# EAGLE design 612_jetracer_328_210 (EAGLE 9.6.2)
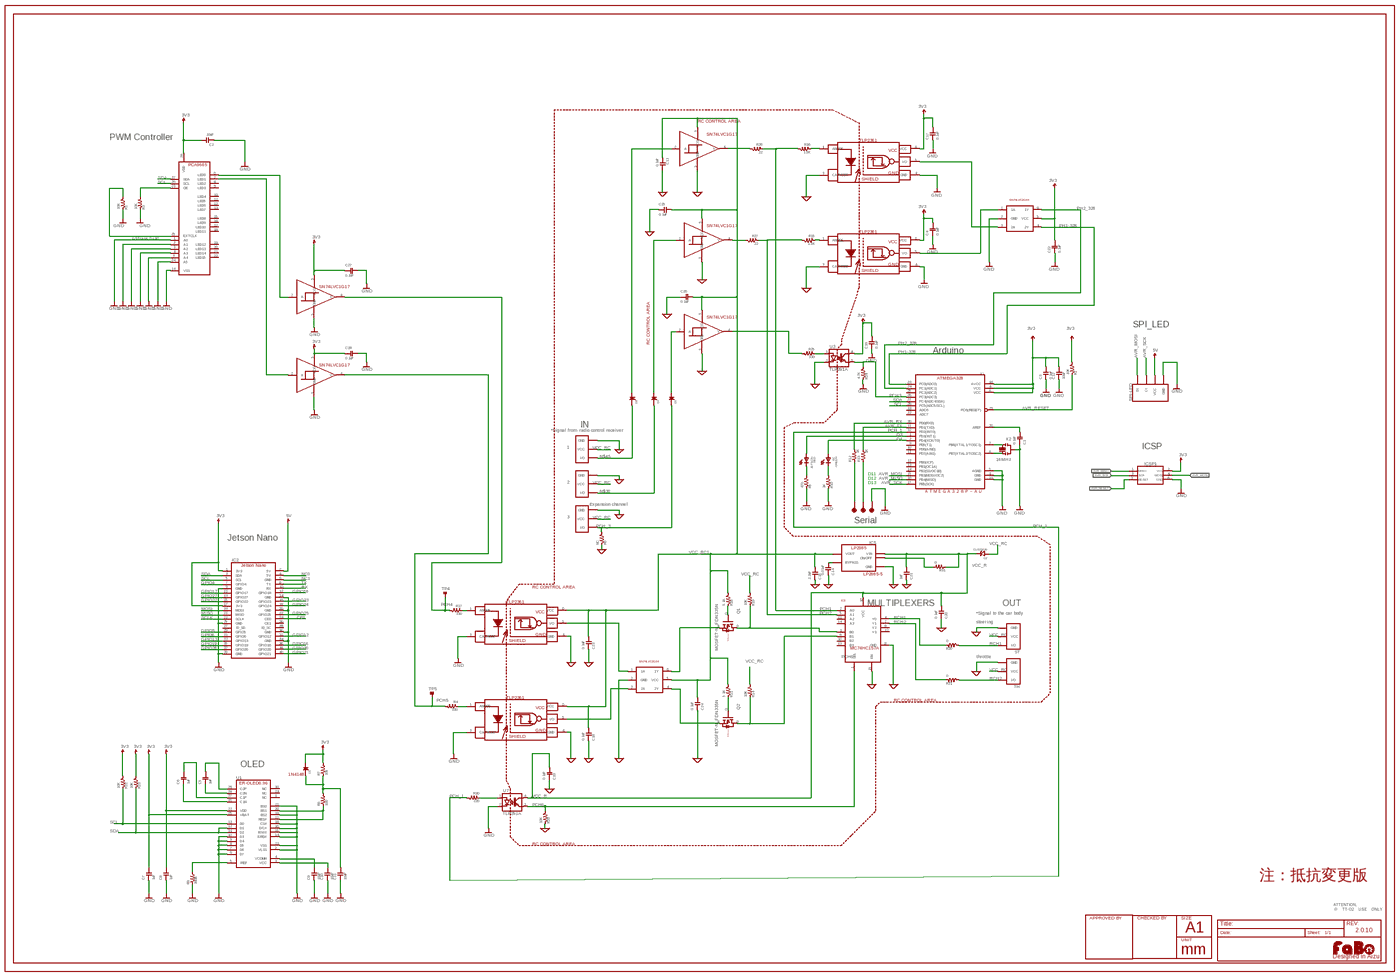
[diagram p0: schematic, sheet 1, overview]
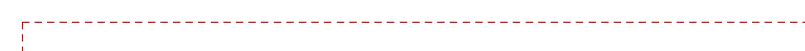
[diagram p1: schematic, sheet 1, part 1 of 4]
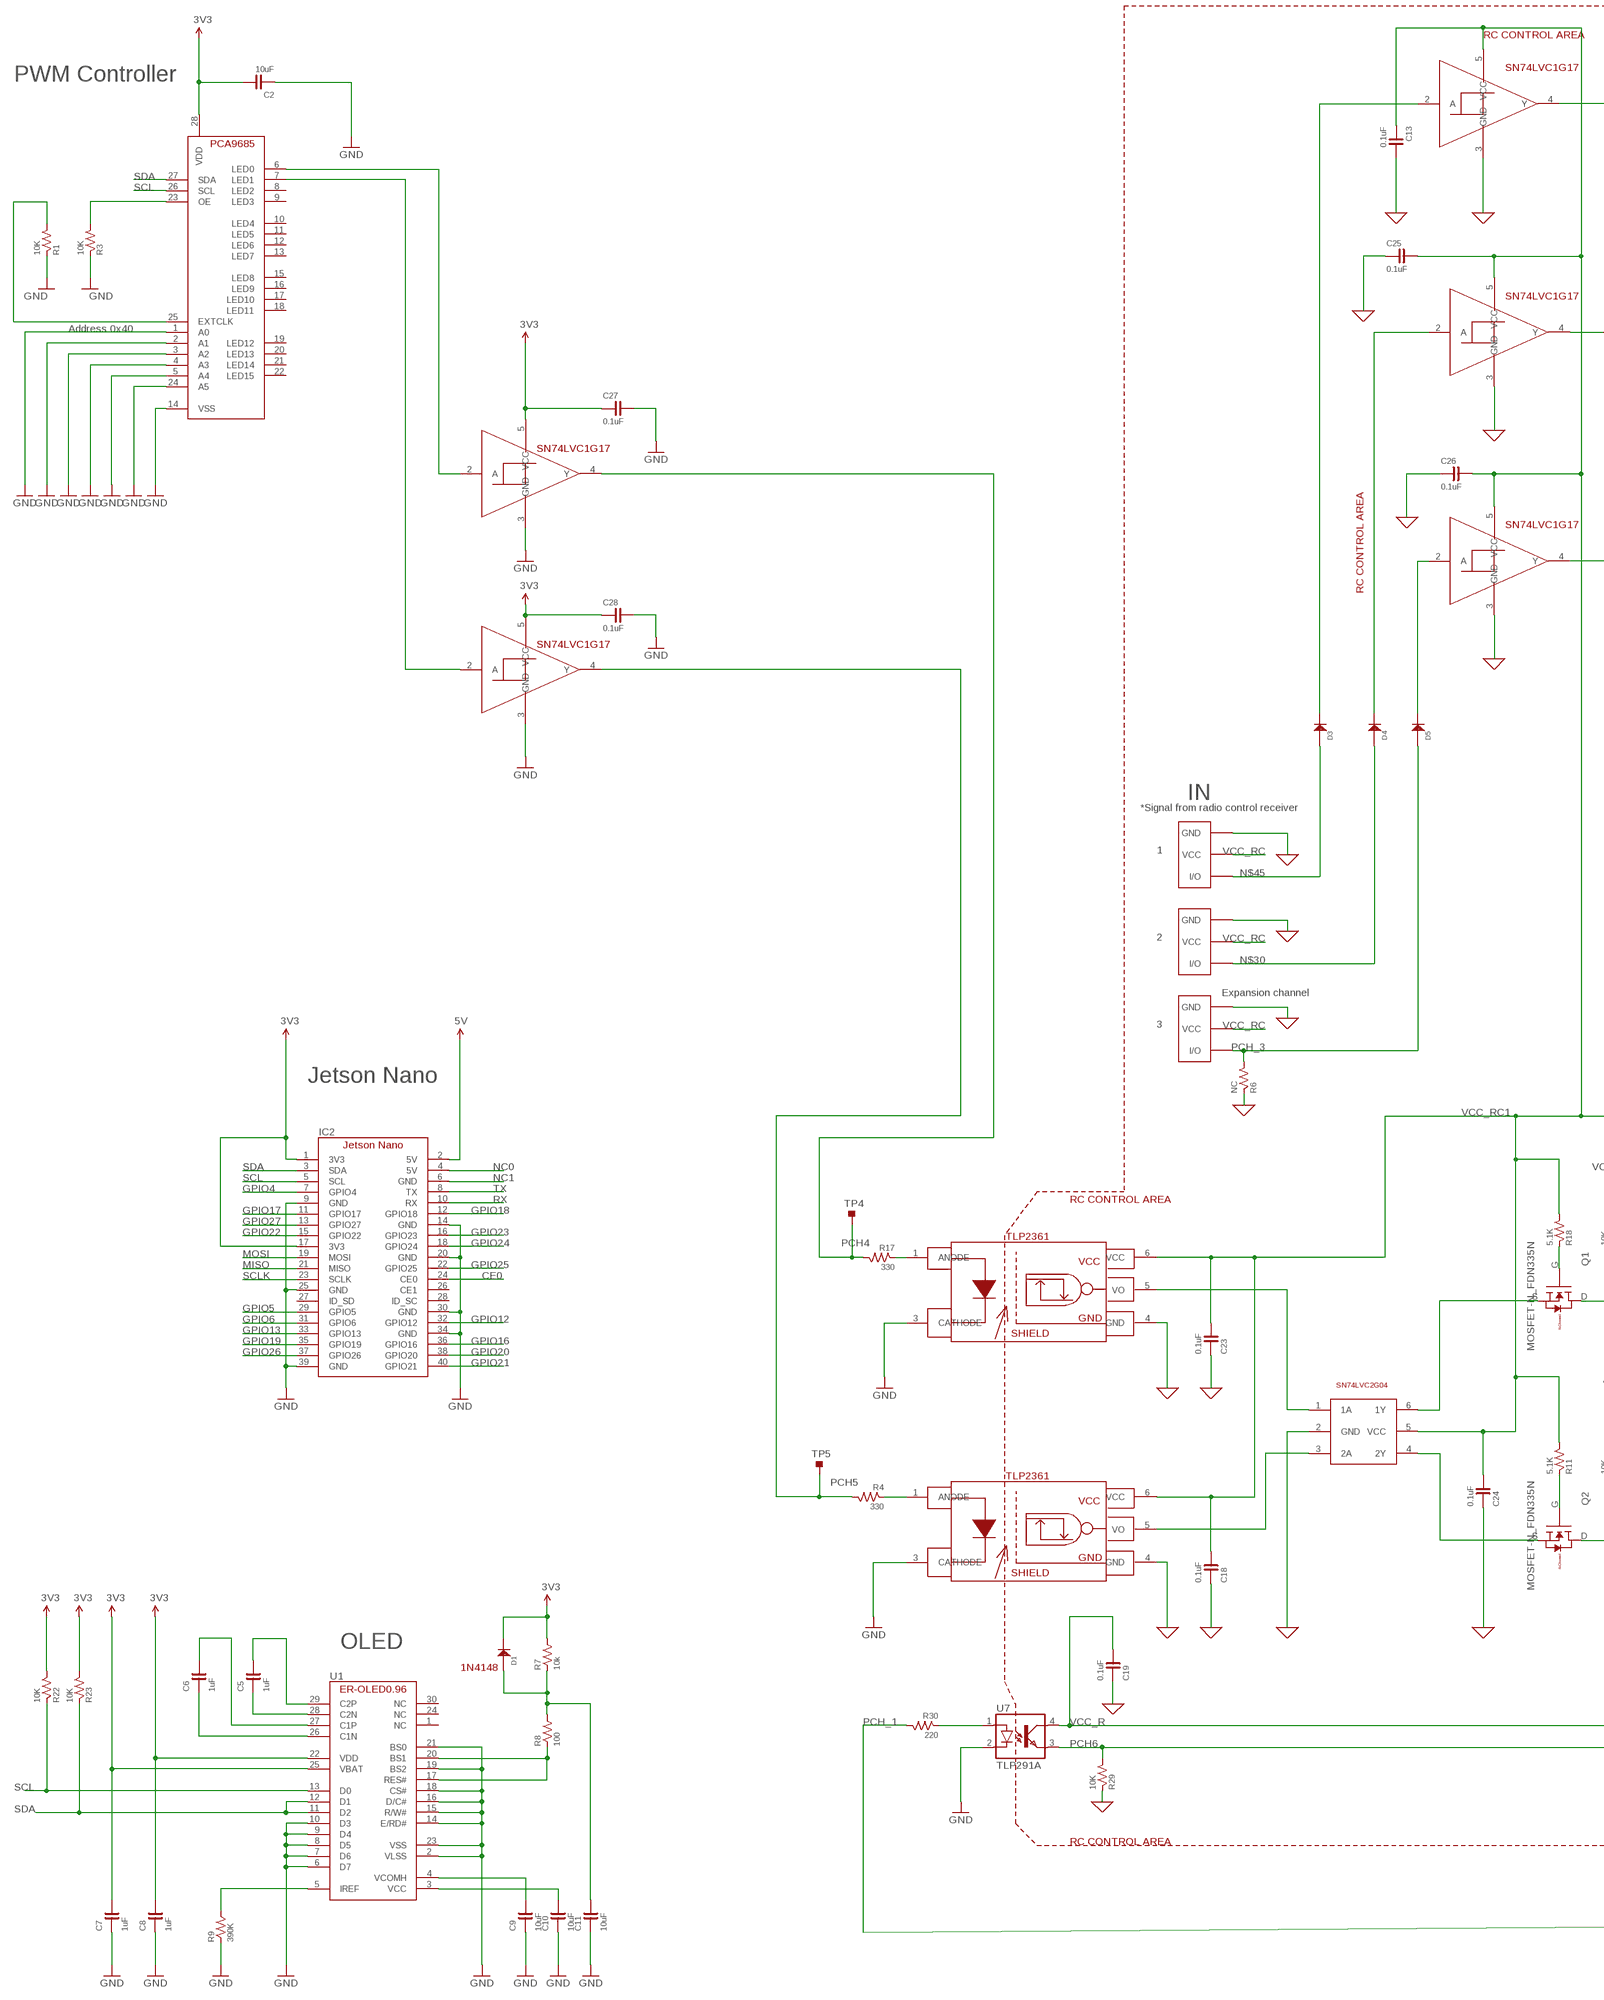
[diagram p2: schematic, sheet 1, part 2 of 4]
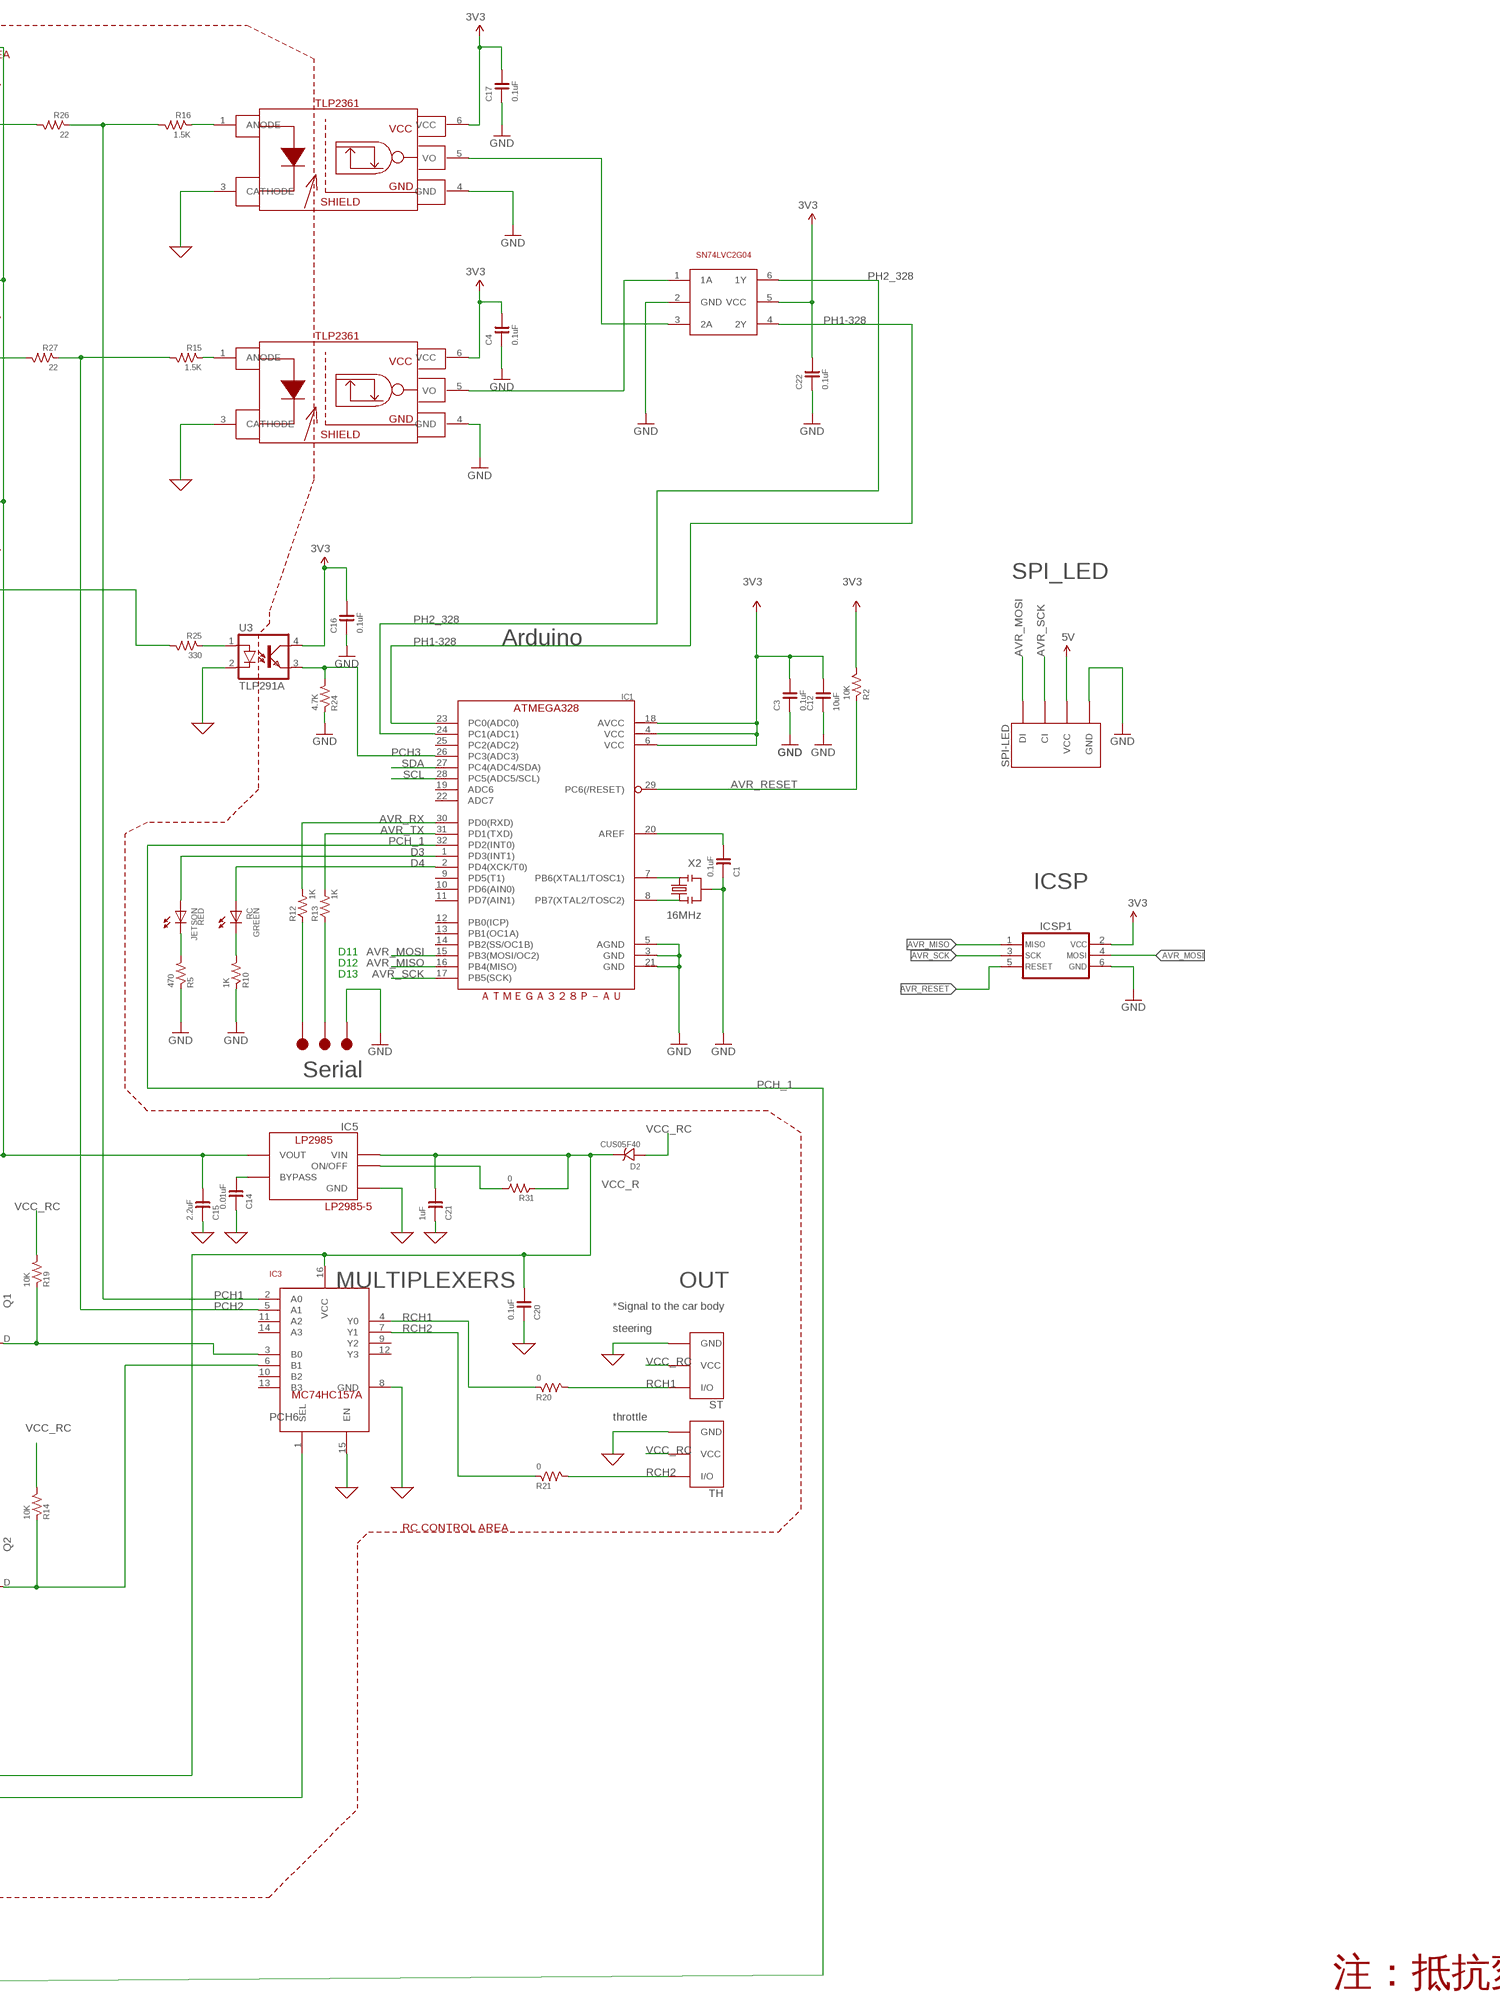
[diagram p3: schematic, sheet 1, part 3 of 4]
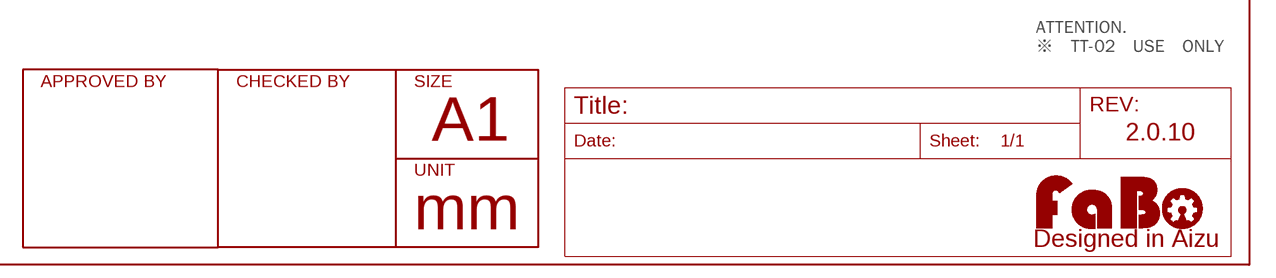
[diagram p4: schematic, sheet 1, part 4 of 4]

## Parts
1  FABO_BRICK_3PIN-HEADER  [FABO_BRICK_3PIN_HEADER]
2  FABO_BRICK_3PIN-HEADER  [FABO_BRICK_3PIN_HEADER]
3  FABO_BRICK_3PIN-HEADER  [FABO_BRICK_3PIN_HEADER]
C1  0.1uF  CAPACITOR-0603  [0603]
C2  10uF  CAPACITOR-0603  [0603]
C3  0.1uF  CAPACITOR-0603-BOTTOM  [0603-BOTTOM]
C4  0.1uF  CAPACITOR-0603-BOTTOM  [0603-BOTTOM]
C5  1uF  CAPACITOR-0603-BOTTOM  [0603-BOTTOM]
C6  1uF  CAPACITOR-0603-BOTTOM  [0603-BOTTOM]
C7  1uF  CAPACITOR-0603-BOTTOM  [0603-BOTTOM]
C8  1uF  CAPACITOR-0603-BOTTOM  [0603-BOTTOM]
C9  10uF  CAPACITOR-0603-BOTTOM  [0603-BOTTOM]
C10  10uF  CAPACITOR-0603-BOTTOM  [0603-BOTTOM]
C11  10uF  CAPACITOR-0603-BOTTOM  [0603-BOTTOM]
C12  10uF  CAPACITOR-0603-BOTTOM  [0603-BOTTOM]
C13  0.1uF  CAPACITOR-0603  [0603]
C14  0.01uF  CAPACITOR-0603  [0603]
C15  2.2uF  CAPACITOR-0603  [0603]
C16  0.1uF  CAPACITOR-0603-BOTTOM  [0603-BOTTOM]
C17  0.1uF  CAPACITOR-0603_NARROW  [0603-NARROW]
C18  0.1uF  CAPACITOR-0603  [0603]
C19  0.1uF  CAPACITOR-0603  [0603]
C20  0.1uF  CAPACITOR-0603  [0603]
C21  1uF  CAPACITOR-0603  [0603]
C22  0.1uF  CAPACITOR-0603-BOTTOM  [0603-BOTTOM]
C23  0.1uF  CAPACITOR-0603  [0603]
C24  0.1uF  CAPACITOR-0603  [0603]
C25  0.1uF  CAPACITOR-0603  [0603]
C26  0.1uF  CAPACITOR-0603  [0603]
C27  0.1uF  CAPACITOR-0603  [0603]
C28  0.1uF  CAPACITOR-0603  [0603]
D1  1N4148  [1N4148W]
D2  CUS05F40  [CUS05F40]
D3  1N4148  [1N4148W]
D4  1N4148  [1N4148W]
D5  1N4148  [1N4148W]
IC1  ATMEGA328P-AU  [TQFP-32]
IC2  JETSON_NANO_NOBORDER  [JETSON_NANO_NOBOARDER]
IC3  MULTIPLEXERSMC74HC157A  [TSSOP-16]
IC4  PCA9685_BOTTOM  [PCA9685_BOTTOM]
IC5  LP2985-33DBV  [SOT-23-5]
ICSP1  ICSP_AVR-TC_NOHOLE  [TC2030]
JETSON  GREEN  LED-0603  [0603]
Q1  MOSFET-N_FDN335N  [SUPERSOT-3]
Q2  MOSFET-N_FDN335N  [SUPERSOT-3]
R1  10K  RESISTOR-0603  [0603]
R2  10K  RESISTOR-0603  [0603]
R3  10K  RESISTOR-0603  [0603]
R4  330  RESISTOR-0603  [0603]
R5  470  RESISTOR-0603  [0603]
R6  NC  RESISTOR-0603  [0603]
R7  10k  RESISTOR-0603-BOTTOM  [0603-BOTTOM]
R8  100  RESISTOR-0603-BOTTOM  [0603-BOTTOM]
R9  390K  RESISTOR-0603-BOTTOM  [0603-BOTTOM]
R10  1K  RESISTOR-0603  [0603]
R11  5.1K  RESISTOR-0603  [0603]
R12  1K  RESISTOR-0603  [0603]
R13  1K  RESISTOR-0603  [0603]
R14  10K  RESISTOR-0603  [0603]
R15  1.5K  RESISTOR-0603  [0603]
R16  1.5K  RESISTOR-0603  [0603]
R17  330  RESISTOR-0603  [0603]
R18  5.1K  RESISTOR-0603  [0603]
R19  10K  RESISTOR-0603  [0603]
R20  0  RESISTOR-0603  [0603]
R21  0  RESISTOR-0603  [0603]
R22  10K  RESISTOR-0603  [0603]
R23  10K  RESISTOR-0603  [0603]
R24  4.7K  RESISTOR-0603  [0603]
R25  330  RESISTOR-0603  [0603]
R26  22  RESISTOR-0603  [0603]
R27  22  RESISTOR-0603  [0603]
R29  10K  RESISTOR-0603  [0603]
R30  220  RESISTOR-0603  [0603]
R31  0  RESISTOR-0603  [0603]
RC  RED  LED-0603  [0603]
SPI-LED  FABO-SPI-LED-B04B  [SPI-B04B-PASK-1]
ST  FABO_BRICK_3PIN-HEADER  [FABO_BRICK_3PIN_HEADER]
T5  SN74LVC2G04  [SOT-23-6]
T6  SN74LVC2G04  [SOT-23-6]
TH  FABO_BRICK_3PIN-HEADER  [FABO_BRICK_3PIN_HEADER]
TP1  TP-15  [TP-15]
TP2  TP-15  [TP-15]
TP3  TP-15  [TP-15]
TP4  TESTPOINT_TPS-SMD-10SN  [TESTPOINT_SMD-10SN]
TP5  TESTPOINT_TPS-SMD-10SN  [TESTPOINT_SMD-10SN]
U1  ER-OLED0.96-1ER-CON30HT-1  [ER-CON30HT-1]
U3  TLP291A  [11-3C1]
U7  TLP291A  [11-3C1]
U8  TLP2361  [TLP2361]
U9  TLP2361  [TLP2361]
U10  TLP2361  [TLP2361]
U11  TLP2361  [TLP2361]
U$7  SN74LVC1G17  [SOT-23]
U$8  SN74LVC1G17  [SOT-23]
U$9  SN74LVC1G17  [SOT-23]
U$10  SN74LVC1G17  [SOT-23]
U$11  LOGO_FABO-M  [LOGO_FABO_MS]
U$14  SN74LVC1G17  [SOT-23]
X2  16MHz  RESONATOR  [CSTNE_V_C]

## Nets
0: 1.GND 2.GND 3.GND C13.2 C14.1 C15.1 C18.1 C19.1 C20.1 C21.1 C23.1 C24.1 C25.1 C26.1 IC3.8(GND) IC3.15(EN) IC5.2(GND) R6.1 R29.1 ST.GND T6.2(GND) TH.GND U3.2(C) U8.3(CATHODE) U9.3(CATHODE) U10.4(GND) U11.4(GND) U$7.3(GND) U$8.3(GND) U$14.3(GND) ; supply symbol labelled GND
3V3: C2.2 C3.2 C4.2 C7.2 C8.2 C12.2 C16.2 C17.2 C22.2 C27.1 C28.1 D1.CATHODE IC1.4(VCC) IC1.6(VCC) IC1.18(AVCC) IC2.1(3V3) IC2.17(3V3) IC4.28(VDD) ICSP1.2 R2.2 R7.2 R22.2 R23.2 T5.5(VCC) U1.22(VDD) U1.25(VBAT) U3.4(COL) U8.6(VCC) U9.6(VCC) U$9.5(VCC) U$10.5(VCC)
5V: IC2.2(5V) SPI-LED.VCC
AVR_MISO: IC1.16(PB4(MISO)) ICSP1.1
AVR_MOSI: IC1.15(PB3(MOSI/OC2)) ICSP1.4 SPI-LED.DI
AVR_RESET: IC1.29(PC6(/RESET)) ICSP1.5 R2.1
AVR_RX: IC1.30(PD0(RXD)) R12.2
AVR_SCK: IC1.17(PB5(SCK)) ICSP1.3 SPI-LED.CI
AVR_TX: IC1.31(PD1(TXD)) R13.2
CE0: IC2.24(CE0)
D3: IC1.1(PD3(INT1)) RC.ANODE
D4: IC1.2(PD4(XCK/T0)) JETSON.ANODE
GND: C1.1 C2.1 C3.1 C4.1 C7.1 C8.1 C9.1 C10.1 C11.1 C12.1 C16.1 C17.1 C22.1 C27.2 C28.2 IC1.3(GND) IC1.5(AGND) IC1.21(GND) IC2.9(GND) IC2.14(GND) IC2.20(GND) IC2.25(GND) IC2.30(GND) IC2.34(GND) IC2.39(GND) IC4.1(A0) IC4.2(A1) IC4.3(A2) IC4.4(A3) IC4.5(A4) IC4.14(VSS) IC4.24(A5) ICSP1.6 R1.1 R3.1 R5.1 R9.1 R10.1 R24.1 SPI-LED.GND T5.2(GND) TP3.1 U1.2(VLSS) U1.6(D7) U1.7(D6) U1.8(D5) U1.9(D4) U1.10(D3) U1.14(E/RD#) U1.15(R/W#) U1.16(D/C#) U1.18(CS#) U1.19(BS2) U1.21(BS0) U1.23(VSS) U7.2(C) U8.4(GND) U9.4(GND) U10.3(CATHODE) U11.3(CATHODE) U$9.3(GND) U$10.3(GND) X2.2
GPIO4: IC2.7(GPIO4)
GPIO5: IC2.29(GPIO5)
GPIO6: IC2.31(GPIO6)
GPIO12: IC2.32(GPIO12)
GPIO13: IC2.33(GPIO13)
GPIO16: IC2.36(GPIO16)
GPIO17: IC2.11(GPIO17)
GPIO18: IC2.12(GPIO18)
GPIO19: IC2.35(GPIO19)
GPIO20: IC2.38(GPIO20)
GPIO21: IC2.40(GPIO21)
GPIO22: IC2.15(GPIO22)
GPIO23: IC2.16(GPIO23)
GPIO24: IC2.18(GPIO24)
GPIO25: IC2.22(GPIO25)
GPIO26: IC2.37(GPIO26)
GPIO27: IC2.13(GPIO27)
MISO: IC2.21(MISO)
MOSI: IC2.19(MOSI)
N$2: R4.1 U11.1(ANODE)
N$3: IC3.3(B0) Q1.D R19.1
N$4: C1.2 IC1.20(AREF)
N$5: IC1.8(PB7(XTAL2/TOSC2)) X2.3
N$6: R12.1 TP1.1
N$7: IC4.23(OE) R3.2
N$8: IC4.25(EXTCLK) R1.2
N$9: R15.1 U9.1(ANODE)
N$10: T5.1(1A) U9.5(VO)
N$11: T5.3(2A) U8.5(VO)
N$12: R16.1 U8.1(ANODE)
N$13: R17.1 U10.1(ANODE)
N$14: T6.1(1A) U10.5(VO)
N$15: IC1.7(PB6(XTAL1/TOSC1)) X2.1
N$16: C6.2 U1.27(C1P)
N$17: R13.1 TP2.1
N$18: T6.3(2A) U11.5(VO)
N$19: R5.2 RC.CATHODE
N$20: JETSON.CATHODE R10.2
N$21: C6.1 U1.26(C1N)
N$22: C5.1 U1.28(C2N)
N$23: C5.2 U1.29(C2P)
N$24: R9.2 U1.5(IREF)
N$25: C9.2 U1.4(VCOMH)
N$26: C10.2 U1.3(VCC)
N$27: R8.1 U1.17(RES#) U1.20(BS1)
N$28: C11.2 D1.ANODE R7.1 R8.2
N$29: D3.CATHODE U$14.2(A)
N$30: 2.I/O D4.ANODE
N$31: C14.2 IC5.4(BYPASS)
N$32: IC5.3(ON/OFF) R31.2
N$33: R25.2 U$8.4(Y)
N$34: Q2.S T6.4(2Y)
N$35: R21.2 TH.I/O
N$36: R20.2 ST.I/O
N$37: Q1.S T6.6(1Y)
N$38: R25.1 U3.1(A)
N$39: Q2.G R11.1
N$40: Q1.G R18.1
N$41: R26.2 U$14.4(Y)
N$42: IC3.6(B1) Q2.D R14.1
N$43: R30.1 U7.1(A)
N$44: R27.2 U$7.4(Y)
N$45: 1.I/O D3.ANODE
N$46: D4.CATHODE U$7.2(A)
N$47: D5.CATHODE U$8.2(A)
N$48: IC4.7(LED1) U$9.2(A)
N$49: IC4.6(LED0) U$10.2(A)
NC0: IC2.4(5V)
NC1: IC2.6(GND)
PCH1: IC3.2(A0) R16.2 R26.1
PCH2: IC3.5(A1) R15.2 R27.1
PCH3: IC1.26(PC3(ADC3)) R24.2 U3.3(EMI)
PCH4: R17.2 TP4.TP U$10.4(Y)
PCH5: R4.2 TP5.TP U$9.4(Y)
PCH6: IC3.1(SEL) R29.2 U7.3(EMI)
PCH_1: IC1.32(PD2(INT0)) R30.2
PCH_3: 3.I/O D5.ANODE R6.2
PH1-328: IC1.23(PC0(ADC0)) T5.4(2Y)
PH2_328: IC1.24(PC1(ADC1)) T5.6(1Y)
RCH1: IC3.4(Y0) R20.1
RCH2: IC3.7(Y1) R21.1
RX: IC2.10(RX)
SCL: IC1.28(PC5(ADC5/SCL)) IC2.5(SCL) IC4.26(SCL) R22.1 U1.13(D0)
SCLK: IC2.23(SCLK)
SDA: IC1.27(PC4(ADC4/SDA)) IC2.3(SDA) IC4.27(SDA) R23.1 U1.11(D2) U1.12(D1)
TX: IC2.8(TX)
VCC_R: C19.2 C20.2 C21.2 D2.C(CATHODE) IC3.16(VCC) IC5.1(VIN) R31.1 U7.4(COL)
VCC_RC: 1.VCC 2.VCC 3.VCC D2.A(ANODE) R14.2 R19.2 ST.VCC TH.VCC
VCC_RC1: C13.1 C15.2 C18.2 C23.2 C24.2 C25.2 C26.2 IC5.5(VOUT) R11.2 R18.2 T6.5(VCC) U10.6(VCC) U11.6(VCC) U$7.5(VCC) U$8.5(VCC) U$14.5(VCC)
Unconnected: IC1.9(PD5(T1)) IC1.10(PD6(AIN0)) IC1.11(PD7(AIN1)) IC1.12(PB0(ICP)) IC1.13(PB1(OC1A)) IC1.14(PB2(SS/OC1B)) IC1.19(ADC6) IC1.22(ADC7) IC1.25(PC2(ADC2)) IC2.26(CE1) IC2.27(ID_SD) IC2.28(ID_SC) IC3.9(Y2) IC3.10(B2) IC3.11(A2) IC3.12(Y3) IC3.13(B3) IC3.14(A3) IC4.8(LED2) IC4.9(LED3) IC4.10(LED4) IC4.11(LED5) IC4.12(LED6) IC4.13(LED7) IC4.15(LED8) IC4.16(LED9) IC4.17(LED10) IC4.18(LED11) IC4.19(LED12) IC4.20(LED13) IC4.21(LED14) IC4.22(LED15) U1.1(NC) U1.24(NC) U1.30(NC)

## Notes on the sheet
- RC CONTROL AREA
- SN74LVC1G17
- PWM Controller
- SN74LVC1G17
- Address 0x40
- SN74LVC1G17
- SN74LVC1G17
- SPI_LED
- RC CONTROL AREA
- Arduino
- SN74LVC1G17
- IN
- *Signal from radio control receiver
- ICSP
- D11
- D12
- D13
- ＡＴＭＥＧＡ３２８Ｐ－ＡＵ
- Expansion channel
- Serial
- Jetson Nano
- LP2985-5
- RC CONTROL AREA
- MULTIPLEXERS | OUT
- *Signal to the car body
- steering
- MC74HC157A
- throttle
- RC CONTROL AREA
- OLED
- 1N4148
- RC CONTROL AREA
- 注：抵抗変更版
- ATTENTION.
  ※　TT-02　USE　ONLY
- 2.0.10

## Library data of the parts
1-3 ST TH = FaBo-Template:FABO_BRICK_3PIN: FaBo Brick 3pin
C1-C17 C20-C22 C25-C28 = FaBo-Capacitor:CAPACITOR: CAPACITOR
C18 C19 C23 C24 = FaBo-Capacitor:CAPACITOR: CAPACITOR; SPICEPREFIX: C
D1 D3-D5 = FaBo-Diode:1N4148
D2 = FaBo-Diode:CUS05F40
IC1 = component:ATMEGA328
IC2 = FaBo-Boards:JETSON_NANO
IC3 = FaBo-Multiplexers:MULTIPLEXERS
IC4 = FaBo-Motor:PCA9685
IC5 = FaBo-Supply:LP2985: LP2985
ICSP1 = component:ICSP_AVR
JETSON RC = FaBo-LED:LED
Q1 Q2 = FaBo-Mosfet:MOSFET-N
R1-R27 R29-R31 = FaBo-Resistors:RESISTOR: RESISTOR
SPI-LED = FaBo-Connetor:FABO-SPI-LED
T5 T6 = FaBo-Transistor:SN74LVC2G04
TP1-TP3 = FaBo-Supply:TP
TP4 TP5 = 52101-101-REV-A_v16:TESTPOINT_TPS: TEST POINT PAD; BOM: EXCLUDE
U1 = FaBo-Display:ER-OLED0.96-1
U3 U7 = FaBo_Photocoupler:TLP291A
U8-U11 = FaBo-etc:TLP2361
U$7-U$10 U$14 = FaBo-LogicIC:SN74LVC1G17
U$11 = FaBo-Logo:LOGO_FABO
X2 = component:RESONATOR

## Board
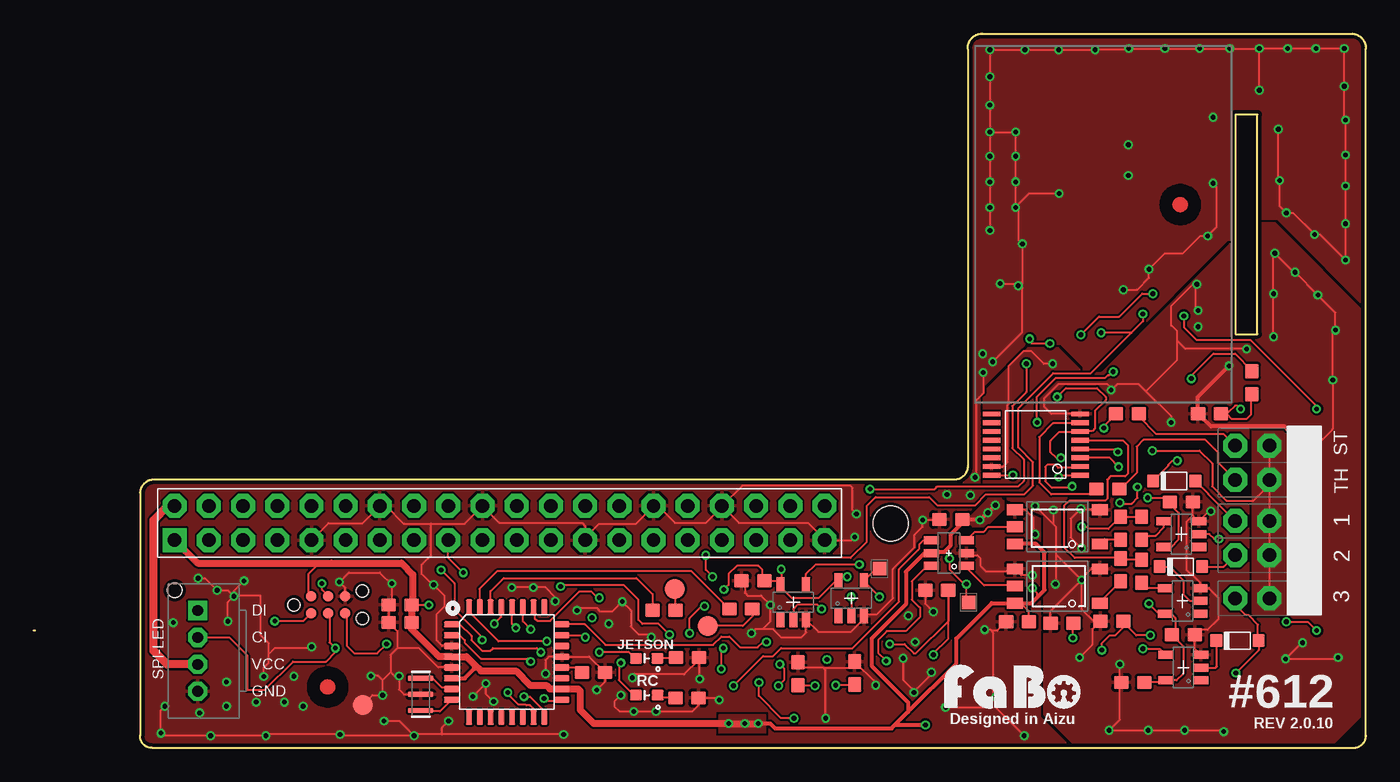
[diagram p5: board, top side]
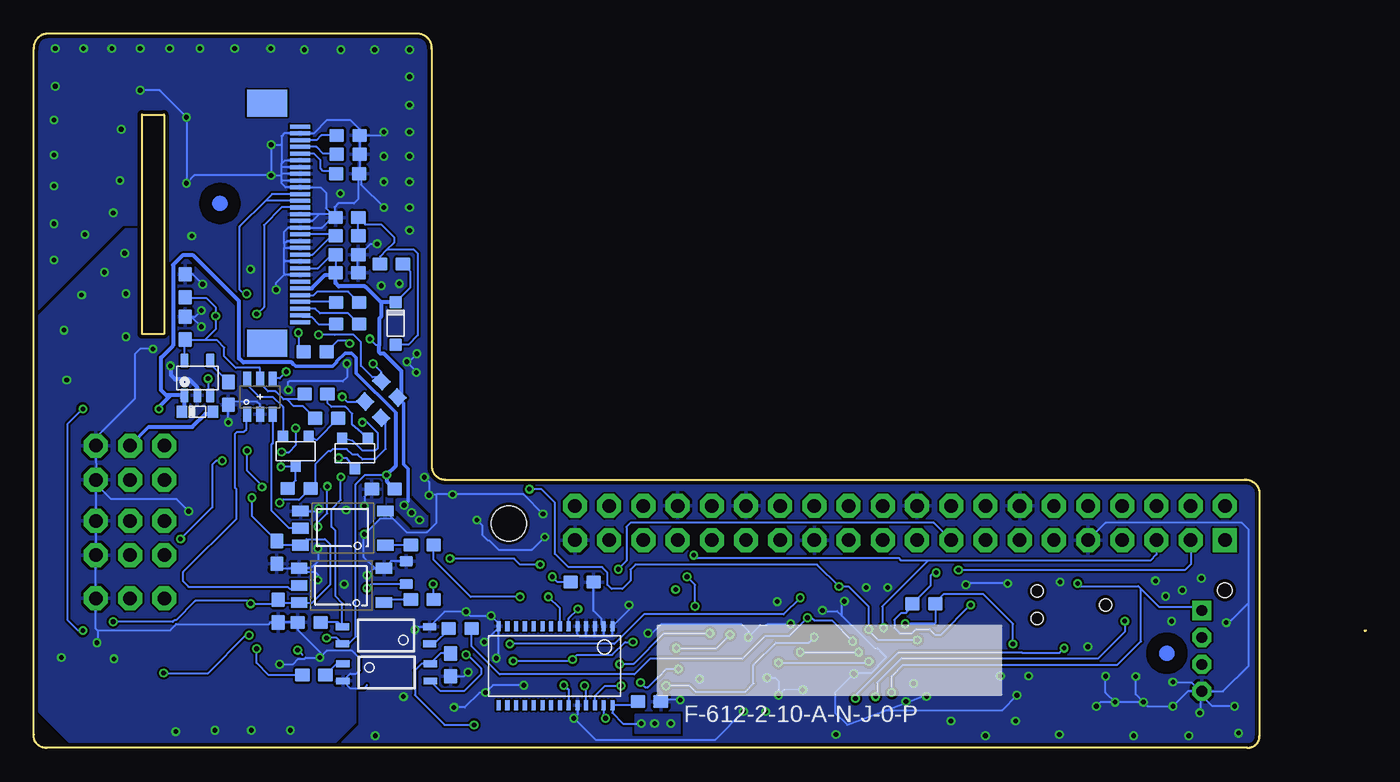
[diagram p6: board, bottom side, seen from below]

Size 98.91 x 53.01 mm. Coordinates in mm from the lower left corner, seen from the top.
Outline: 0.1,8.71 0,8.71
Outline: 69.35,51.86 69.35,20.91 arc-90 68.35,19.91 8.95,19.91 arc90 7.9,18.91 7.9,0.91 arc97 8.8,0.01 97.9,0.01 arc103 98.9,1.01 98.9,51.86 arc91 97.9,53.01 70.45,53.01 arc95 69.35,51.86
Outline: 90.87,30.72 90.87,47 89.23,47 89.23,30.72 90.87,30.72
Copper layers (1*16): Top 0.035mm / dielectric 1.6mm / Bottom 0.035mm
Design rules "PCBway": minimum track width 6mil, minimum drill 12mil, track to track 6mil, track to pad 6mil, pad to pad 6mil, via to via 6mil, smd to smd 6mil, copper to edge 10mil, drill to drill 10mil, minimum pad ring 10mil, minimum via ring 6mil, stop-mask expansion 2mil, vias tented up to drill 100mil, thermal gap 8mil
Holes 2.6 mm at 63.63,16.65
bRestrict: 11 lines

### Footprints (pad centres in the part's own frame; a part is rotated, then mirrored left to right if it is on the bottom)
FABO_BRICK_3PIN_HEADER = drill 1 pad 1.778 octagon: GND -2.54,0; I/O 2.54,0; VCC 0,0
0603 = smd 1.1 x 1: 1 -0.85,0; 2 0.85,0
0603-BOTTOM = smd 1.1 x 1 bottom: 1 -0.85,0; 2 0.85,0
0603-NARROW = smd 0.71 x 1: 1 -0.85,0; 2 0.85,0
1N4148W = smd 0.9 x 0.95: ANODE 0,0; CATHODE 3.15,0
CUS05F40 = smd 0.8 x 0.9: A -1.15,0; C 1.15,0
TQFP-32 = smd 1.1 x 0.45: 1 -4.1,2.8; 2 -4.1,2; 3 -4.1,1.2; 4 -4.1,0.4; 5 -4.1,-0.4; 6 -4.1,-1.2; 7 -4.1,-2; 8 -4.1,-2.8; 17 4.1,-2.8; 18 4.1,-2; 19 4.1,-1.2; 20 4.1,-0.4; 21 4.1,0.4; 22 4.1,1.2; 23 4.1,2; 24 4.1,2.8 | smd 0.45 x 1.1: 9 -2.8,-4.1; 10 -2,-4.1; 11 -1.2,-4.1; 12 -0.4,-4.1; 13 0.4,-4.1; 14 1.2,-4.1; 15 2,-4.1; 16 2.8,-4.1; 25 2.8,4.1; 26 2,4.1; 27 1.2,4.1; 28 0.4,4.1; 29 -0.4,4.1; 30 -1.2,4.1; 31 -2,4.1; 32 -2.8,4.1
JETSON_NANO_NOBOARDER = drill 1 pad 1.778 square: 1 1.27,1.27 | drill 1 pad 1.778 octagon: 2 1.27,3.81; 3 3.81,1.27; 4 3.81,3.81; 5 6.35,1.27; 6 6.35,3.81; 7 8.89,1.27; 8 8.89,3.81; 9 11.43,1.27; 10 11.43,3.81; 11 13.97,1.27; 12 13.97,3.81; 13 16.51,1.27; 14 16.51,3.81; 15 19.05,1.27; 16 19.05,3.81; 17 21.59,1.27; 18 21.59,3.81; 19 24.13,1.27; 20 24.13,3.81; 21 26.67,1.27; 22 26.67,3.81; 23 29.21,1.27; 24 29.21,3.81; 25 31.75,1.27; 26 31.75,3.81; 27 34.29,1.27; 28 34.29,3.81; 29 36.83,1.27; 30 36.83,3.81; 31 39.37,1.27; 32 39.37,3.81; 33 41.91,1.27; 34 41.91,3.81; 35 44.45,1.27; 36 44.45,3.81; 37 46.99,1.27; 38 46.99,3.81; 39 49.53,1.27; 40 49.53,3.81
TSSOP-16 = smd 0.36 x 1.3: 1 -2.275,-3.28; 2 -1.625,-3.28; 3 -0.975,-3.28; 4 -0.325,-3.28; 5 0.325,-3.28; 6 0.975,-3.28; 7 1.625,-3.28; 8 2.275,-3.28; 9 2.275,3.28; 10 1.625,3.28; 11 0.975,3.28; 12 0.325,3.28; 13 -0.325,3.28; 14 -0.975,3.28; 15 -1.625,3.28; 16 -2.275,3.28
PCA9685_BOTTOM = smd 0.3 x 0.75 bottom: 1 4.3,-2.93; 2 3.65,-2.93; 3 3,-2.93; 4 2.35,-2.93; 5 1.7,-2.93; 6 1.05,-2.93; 7 0.4,-2.93; 8 -0.25,-2.93; 9 -0.9,-2.93; 10 -1.55,-2.93; 11 -2.2,-2.93; 12 -2.85,-2.93; 13 -3.5,-2.93; 14 -4.15,-2.93; 15 -4.15,2.92; 16 -3.5,2.92; 17 -2.85,2.92; 18 -2.2,2.92; 19 -1.55,2.92; 20 -0.9,2.92; 21 -0.25,2.92; 22 0.4,2.92; 23 1.05,2.92; 24 1.7,2.92; 25 2.35,2.92; 26 3,2.92; 27 3.65,2.92; 28 4.3,2.92
SOT-23-5 = smd 0.6 x 1.05: 1 -0.95,-1.3; 2 0,-1.3; 3 0.95,-1.3; 4 0.95,1.3; 5 -0.95,1.3
TC2030 = smd 0.787 x 0.787: 1 1.27,-0.635; 2 1.27,0.635; 3 2.54,-0.635; 4 2.54,0.635; 5 3.81,-0.635; 6 3.81,0.635 | hole 0.889: 0,0; 5.08,-1.016; 5.08,1.016
0603' = smd 0.9 x 0.8: ANODE -0.8,0; CATHODE 0.8,0
SUPERSOT-3 = smd 0.76 x 0.76: D 0,1.15; G -0.95,-1.15; S 0.95,-1.15
SPI-B04B-PASK-1 = drill 0.8 pad 1.422 octagon: CI 1,1.27; GND -3,1.27; VCC -1,1.27 | drill 0.8 pad 1.422 square: DI 3,1.27 | hole 1.1: 4.5,2.97
SOT-23-6 = smd 0.6 x 1.1: 1 -0.95,-1.3; 2 0,-1.3; 3 0.95,-1.3; 4 0.95,1.3; 5 0,1.3; 6 -0.95,1.3
TP-15 = smd 1.5 x 1.5: 1 0,0
TESTPOINT_SMD-10SN = smd 1 x 1: TP 0,0
ER-CON30HT-1 = smd 0.3 x 1.5 bottom: 1 7,-0.23; 2 6.5,-0.23; 3 6,-0.23; 4 5.5,-0.23; 5 5,-0.23; 6 4.5,-0.23; 7 4,-0.23; 8 3.5,-0.23; 9 3,-0.23; 10 2.5,-0.23; 11 2,-0.23; 12 1.5,-0.23; 13 1,-0.23; 14 0.5,-0.23; 15 0,-0.23; 16 -0.5,-0.23; 17 -1,-0.23; 18 -1.5,-0.23; 19 -2,-0.23; 20 -2.5,-0.23; 21 -3,-0.23; 22 -3.5,-0.23; 23 -4,-0.23; 24 -4.5,-0.23; 25 -5,-0.23; 26 -5.5,-0.23; 27 -6,-0.23; 28 -6.5,-0.23; 29 -7,-0.23; 30 -7.5,-0.23 | smd 2 x 3 bottom: 31 -9.07,-2.67; 32 8.74,-2.67
11-3C1 = smd 1 x 0.5: 1 -3.24,0.635; 2 -3.24,-0.635; 3 3.24,-0.635; 4 3.24,0.635
TLP2361 = smd 0.8 x 1.2: 1 -1.27,-3.15; 3 1.27,-3.15; 4 1.27,3.15; 5 0,3.15; 6 -1.27,3.15
SOT-23 = smd 1.1 x 0.6: 1 -1.3,0.95; 2 -1.3,0; 3 -1.3,-0.95; 4 1.3,-0.95; 5 1.3,0.95
CSTNE_V_C = smd 0.4 x 1.9: 1 1.2,0; 2 0,0; 3 -1.2,0

### Placement (x,y rotation side)
1  91.75,16.84 180 top
2  91.75,14.3 180 top
3  91.75,11.1 180 top
C1  41.57,5.6 180 top
C2  53.2,3.44 180 bottom
C3  27.2,9.31 180 bottom
C4  73.05,9.36 180 bottom
C5  75.6,31.46 0 top
C6  75.6,33.06 0 top
C7  75.65,35.26 0 top
C8  75.65,36.61 0 top
C9  75.55,44.06 0 top
C10  75.55,45.46 0 top
C11  75.65,39.36 180 top
C12  27.2,10.61 180 bottom
C13  85.2,18.26 0 top
C14  84.45,26.31 90 bottom
C15  87.65,31.16 270 bottom
C16  67.95,6.16 90 top
C17  71.25,13.01 270 bottom
C18  80.75,10.16 90 bottom
C19  76.35,9.26 0 top
C20  72.95,19.21 0 bottom
C21  87.3,24.81 0 top
C22  68.1,16.96 180 bottom
C23  80.85,14.51 90 bottom
C24  87.65,34.31 270 bottom
C25  85.35,8.41 180 top
C26  81.6,4.86 0 top
C27  53.4,12.41 180 top
C28  58.2,12.31 0 bottom
D1  72.03,29.93 90 bottom
D2  86.75,24.96 180 bottom
D3  86.25,19.81 180 top
D4  86.75,13.46 180 top
D5  90.95,7.96 180 top
IC1  35.12,6.37 0 top
IC2  9.19,14.15 0 top
IC3  74.4,22.51 90 top
IC4  60.24,6.09 180 top
IC5  86.75,27.46 0 bottom
ICSP1  19.33,10.62 0 top
JETSON  GREEN  [0603']  45.52,3.92 0 top
Q1  79.45,22.01 180 bottom
Q2  75.05,21.86 180 bottom
R1  56.75,5.51 270 top
R2  32.8,10.71 180 bottom
R3  60.95,5.56 270 top
R4  70.05,15.06 0 bottom
R5  48.55,6.71 180 top
R6  80.05,9.41 0 top
R7  72.35,35.91 180 top
R8  75.65,38.01 180 top
R9  75.6,42.61 0 top
R10  48.5,3.71 180 top
R11  77.95,26.26 180 bottom
R12  46.8,10.21 180 top
R13  52.5,10.31 180 top
R14  73.7,25.11 315 bottom
R15  80.7,13.21 90 top
R16  80.7,16.31 90 top
R17  70.05,11.01 0 bottom
R18  77.15,24.46 180 bottom
R19  79.2,19.26 0 bottom
R20  81.2,24.81 0 top
R21  79.75,19.21 0 top
R22  78,29.41 0 bottom
R23  72.48,26.61 315 bottom
R24  67.05,11.71 0 top
R25  78.1,5.41 180 bottom
R26  82.25,16.31 270 top
R27  82.25,13.11 270 top
R29  78.45,9.31 0 bottom
R30  67.25,8.86 0 bottom
R31  90.45,27.11 90 top
RC  RED  [0603']  45.51,6.65 0 top
SPI-LED  13.44,7.2 90 top
ST  91.75,22.44 180 top
T5  67.95,14.46 90 top
T6  82.1,26.06 0 bottom
TH  91.75,19.9 180 top
TP1  47.6,11.81 0 top
TP2  50.06,9.06 0 top
TP3  24.44,3.2 0 top
TP4  69.4,10.81 0 top
TP5  62.8,13.31 0 top
U1  78.9,39.11 90 top
U3  72.7,5.61 0 bottom
U7  72.75,8.36 180 bottom
U8  76,16.41 90 top
U9  76,12.01 90 top
U10  76.05,12.06 90 bottom
U11  75.95,16.31 90 bottom
U$1  [MARK_POINT_3MM]  85.12,40.32 0 top
U$2  [MARK_POINT_3MM]  85.08,40.41 0 bottom
U$3  [MARK_POINT_3MM]  14.78,7.02 0 bottom
U$6  [MARK_POINT_3MM]  21.83,4.52 0 top
U$7  85.3,10.91 180 top
U$8  85.35,5.96 180 top
U$9  60.7,11.11 90 top
U$10  56.4,10.81 90 top
U$11  72.67,2.55 0 top
U$14  85.2,15.86 180 top
X2  28.74,3.97 90 top

### Tracks (layer width: path | path; a pad name or v marks a point on that pad's centre or on a via)
0  (via drill 0.35)
  Top 0.152: IC3.15 71.98,20.88 72.3,21.2 72.3,25.43 72.4,25.54 72.4,28.34 73.51,29.46 74.05,29.46 75,28.51 v75.65,28.51 | v80,26.56 80.08,26.63 | 80.08,26.63 80.45,27.01 82.05,27.01 82.55,26.51 | 82.55,26.51 82.6,26.51 84.9,28.81 84.9,30.21 | 77.8,12.36 v77.8,12.46 77.75,12.51 | 77.8,12.36 77.8,10.31 78.7,9.41 R6.1 78.6,8.81 78.6,7.66 v77.65,6.71 | v74.35,17.96 75.7,16.61 | 75.9,14.36 77.75,12.51 | 75.9,14.36 75.9,16.41 75.7,16.61 | C19.1 75.5,10.16 77.7,12.36 77.8,12.36 | v77.8,14.81 77,15.61 77,17.01 v77.75,17.76 77.83,17.68 U8.3 | IC3.8 75.58,24.78 75.05,25.31 75.05,25.96 76.11,27.01 79.7,27.01 80.08,26.63 | U9.3 78.52,13.28 77.75,12.51 | v75.7,17.66 75.7,16.61 | 75.9,14.36 75.9,12.21 v75.85,12.16 | 84.9,30.21 84.9,30.91 84.45,31.36 84.45,32.81 86.05,34.41 86.3,34.41 | 86.3,34.41 v86.35,34.41 | v86.45,32.46 86.3,32.61 86.3,34.41 | v90.05,29.61 85.5,29.61 84.9,30.21 | 86.25,17.06 U$14.3 87.25,17.56 v87.4,17.56 | 86.25,17.06 86.05,17.26 C13.2 | 86.25,17.06 85.85,17.06 85.6,16.81 85.6,13.19 85.91,12.88 85.91,12.95 86.6,12.26 U$7.3 87.25,11.86 87.95,11.16 87.95,9.56 87.15,8.76 86.55,8.76 C25.1 86.2,7.36 U$8.3 | C26.1 80.65,4.96 | 80.65,4.96 v80.65,6.21 | v84.45,24.16 84.45,24.61 82.55,26.51 | ST.GND 95.23,22.44 96.45,23.66 v96.45,27.31 96.45,30.81 v96.65,31.01 96.65,32.31 v95.35,33.61 v93.65,35.31 93.55,35.31 v92.15,36.71 92.05,36.61 v92.05,33.71 v92.05,30.51 | 80.65,4.96 80.65,2.11 v79.85,1.31 v82.75,1.31 v85.45,1.31 88.25,1.31 v88.35,1.21 | v96.85,6.71 96.75,6.61 v92.95,6.61 94.15,7.81 v94.2,7.81
  Top 0.305: ST.GND 92.86,23.86 87.4,23.86 C21.1 86.45,26.05 v88.75,28.35
  Bottom 0.152: v80,26.56 80,27.16 79.95,27.21 75.95,27.21 75.65,27.51 v75.65,28.51 | 74.15,4.66 74.4,4.41 75.38,4.41 U3.2 75.41,5.51 74.95,5.51 74.7,5.76 74.7,6.66 75.25,7.21 77.15,7.21 77.62,6.73 | 94.29,19.61 TH.GND 94.28,19.82 ST.GND 94.33,22.48 94.33,22.99 91.4,25.92 91.4,29.21 91,29.61 v90.05,29.61 | 94.29,19.61 94.31,16.96 1.GND 94.31,14.36 94.27,14.32 2.GND 3.GND 94.29,8.84 94.15,8.71 94.1,8.71 | 88.7,28.3 v88.75,28.35 | T6.2 82.1,25.46 82.35,25.71 84.2,25.71 C14.1 v84.45,24.16 | C23.1 80.52,13.33 U10.4 | U10.4 78.93,13.06 78,13.06 77.8,12.86 v77.8,12.46 | C20.1 74.35,18.66 v74.35,17.96 | 94.1,8.71 88.8,8.71 88.33,9.18 81.43,9.18 81.3,9.31 C18.1 R29.1 79.3,8.76 77.62,7.08 77.62,6.73 | U11.4 77.93,17.58 v77.75,17.76 | v77.8,14.81 77.8,13.86 78.33,13.33 U10.4 | 77.62,6.73 v77.65,6.71 78.72,6.71 78.82,6.6 79.26,6.6 79.65,6.21 v80.65,6.21 | v86.35,34.41 87.1,35.16 C24.1 | 87.2,32.01 86.9,32.01 v86.45,32.46 | v86.45,31.26 87.2,32.01 | 87.2,32.01 C15.1 | v87.4,17.56 88.3,18.46 93.15,18.46 94.29,19.59 94.29,19.61 | v94.2,7.81 94.1,7.91 94.1,8.71
  Bottom 0.305: IC5.2 86.75,26.76 87.35,27.36 88.4,27.36 88.7,27.66 88.7,28.3
  pour Bottom (rank 2): 77.55,-0.64 75,1.91 75,14.49 73,16.49 73,26.56 75.4,28.96 82,28.96 82.3,29.26 82.3,31.06 89.75,38.51 92.1,38.51 99.15,31.46 99.15,3.31 95.2,-0.64
  pour Top (rank 2): 70.55,19.21 70.55,26.41 73.85,29.71 76.05,29.71 77.9,27.86 79.3,27.86 90.4,38.96 92.15,38.96 99.25,31.86 99.25,3.06 95.75,-0.44 77.95,-0.44 75.05,2.46 75.05,17.21
3V3  (via drill 0.35)
  Top 0.152: 28.05,11.41 28.15,11.41 | 28.15,10.61 v29.34,10.61 | ICSP1.2 20.4,11.45 20.4,12.91 21.2,13.71 22.1,13.71 | U9.6 72.85,11.09 72.95,11.09 73.9,10.14 C4.2 | 69,16.96 C22.2 | v75.45,30.01 74.1,30.01 73.95,30.16 v73.95,30.36 | v74.15,11.86 74.48,11.53 74.48,11.13 | 55.42,12.48 55.35,12.41 C27.1 54.1,12.56 54.1,13.21 53.8,13.51 52.2,13.51 51.6,12.91 51.6,12.11 v51.24,11.75 | 55.42,12.48 55.52,12.58 55.52,13.22 v55.5,13.25 | v60.4,12.71 60.3,12.71 60.2,12.81 60.15,12.81 U$9.5 59.55,12.41 58.25,11.11 56.3,11.11 55.45,11.96 U$10.5 55.42,12.08 55.42,12.48 | v31.9,13.01 30.78,14.13 IC2.17
  Top 0.305: 28.05,11.41 C12.2 | 39.2,4.38 IC1.18 | v53.8,1.81 54.7,1.81 55.05,1.46 63.7,1.46 63.95,1.7 | IC1.6 32.01,5.17 32.7,5.86 32.7,6.21 | 63.95,1.7 v66.2,1.7 | 63.95,1.7 64.92,2.68 | 64.92,2.68 68.5,6.26 68.5,8.11 71.13,10.74 U9.6 74.08,10.74 74.48,11.13 75.05,11.71 75.05,14.51 74.42,15.14 U8.6 | 69,16.96 69,16.76 68.1,15.86 68.1,15.06 67.6,14.56 66.65,14.56 T5.5 66.15,14.46 64.75,13.06 64.75,10.66 62.2,8.11 62.2,6.1 64.92,3.38 64.92,2.68 | C22.2 70.2,16.96 v70.25,16.91 70.8,17.46 v70.85,17.46 v71.4,18.01
  Top 0.508: IC2.1 12.17,13.71 22.1,13.71 27.3,13.71 28.15,12.86 28.15,11.41 28.15,10.61 | C12.2 C3.2 28.05,8.81 30.09,6.77 IC1.4 32.14,6.77 32.7,6.21 33.2,5.71 35.8,5.71 36.87,4.64 38.07,4.64 38.32,4.38 39.2,4.38 | v53.8,1.81 v52.8,1.81 v51.6,1.81 41.6,1.81 40.6,2.81 40.6,4.21 40.44,4.37 IC1.18
  Bottom 0.152: v29.34,10.61 31.54,8.41 32,8.41 32.4,8.81 33.4,8.81 33.7,8.51 34.6,8.51 35,8.91 35,9.51 34.5,10.01 34.15,10.01 33.65,10.57 R2.2 32.3,12.06 32.3,12.81 32.1,13.01 v31.9,13.01 | R7.2 70.95,35.36 70.95,34.16 D1.CATHODE | U1.22 77.8,35.61 76.8,36.61 C8.2 C7.2 | v53.8,1.81 55.15,1.81 55.94,2.6 IC4.28 54.31,3.17 C2.2 | v66.2,1.7 68.4,1.7 70.6,3.91 70.6,5.76 70.12,6.24 U3.4 68.7,7.01 C16.2 | v75.45,30.01 75.65,30.21 76.35,30.21 R22.2 | v73.95,30.36 73.5,29.91 73.25,29.91 | C17.2 73.85,12.16 v74.15,11.86 | C28.1 60,12.31 v60.4,12.71 | IC2.17 32.07,16.71 54.6,16.71 54.9,16.41 54.9,13.91 55.5,13.31 v55.5,13.25
  Bottom 0.254: v71.4,18.01 71.1,18.31 71.1,20.71 71.45,21.06 71.45,25.58 R23.2
  Bottom 0.305: 73.12,33.08 74.3,34.26 76.25,34.26 76.5,34.51 76.5,35.11 | 76.5,35.11 C7.2 | U1.25 78.25,34.11 77.25,35.11 76.5,35.11 | R23.2 71.6,26.29 71.6,27.96 72.9,29.26 73.15,29.26 73.25,29.36 73.25,29.91 73.25,31.86 73.12,31.99 73.12,33.08 | D1.CATHODE 73.12,33.08
  pour Top (no thermals): 50.9,2.46 54.3,2.46 54.3,1.11 50.9,1.11
  pour Bottom (no thermals): 50.9,2.46 54.25,2.46 54.25,1.11 50.9,1.11
  pour Top (no thermals): 69.6,16.61 69.6,17.21 70.9,18.51 71.8,18.51 72,18.31 72,17.71 70.75,16.46 69.75,16.46
  pour Bottom (no thermals): 69.7,16.51 69.7,17.21 70.95,18.46 71.9,18.46 71.95,18.41 71.95,17.66 70.75,16.46 69.75,16.46
5V
  Top 0.61: SPI-LED.VCC 9.91,6.2 8.9,7.21 8.9,16.91 9.95,17.96 IC2.2
AVR_MISO  (via drill 0.35)
  Top 0.152: ICSP1.1 20.02,9.41 v17.9,9.41 | v36.4,3.81 36.85,3.81 37.92,2.73 IC1.16
  Bottom 0.152: v36.4,3.81 36.28,3.93 36.28,4.86 34.48,6.66 19.85,6.66 17.9,8.61 v17.9,9.41
AVR_MOSI  (via drill 0.35)
  Top 0.152: ICSP1.4 21.4,11.72 v21.4,12.21 | IC1.15 37.12,2.89 36.85,3.16 36.56,3.16 36.5,3.21 35.99,3.21 35.2,4.01 v35.2,4.11
  Bottom 0.152: v21.4,12.21 21.2,12.01 16.9,12.01 16.7,11.81 | SPI-LED.DI 12.43,10.46 15.35,10.46 16.7,11.81 | 16.7,11.81 16.7,7.91 18.45,6.16 34.38,6.16 35.2,5.33 v35.2,4.11
AVR_RESET  (via drill 0.35)
  Top 0.152: ICSP1.5 23.24,9.88 23.24,7.57 23.8,7.01 25.5,7.01 v26.2,7.71 | v34.2,9.21 34.72,9.73 IC1.29
  Bottom 0.152: v26.2,7.71 26.2,9.21 28.4,11.41 31.35,11.41 32.2,10.56 31.95,10.56 | v34.2,9.21 32,9.21 31.95,9.26 31.95,10.56 | R2.1 31.95,10.56
AVR_RX
  Top 0.152: R12.2 45.95,11.41 44.75,12.61 34.9,12.61 33.92,11.63 IC1.30 34,10.55
AVR_SCK  (via drill 0.35)
  Top 0.152: SPI-LED.CI 14.51,8.2 15.85,6.86 15.85,4.31 17.15,4.31 19.25,6.41 21.7,6.41 22.4,7.11 v22.4,7.41 21.97,7.84 21.97,9.88 ICSP1.3 | v37.89,3.66 38.04,3.51 39.16,3.51 IC1.17
  Bottom 0.152: v22.4,7.41 22.75,7.06 25.51,7.06 25.52,7.05 34.72,7.05 38.07,3.7 37.85,3.7 | v37.89,3.66 37.85,3.7 | 37.85,3.7 37.79,3.7
AVR_TX
  Top 0.152: IC1.31 33.16,10.44 33.1,10.5 33.1,11.81 34.4,13.11 48.85,13.11 R13.2
D3  (via drill 0.35)
  Top 0.152: v37.65,7.11 37.35,7.41 34.1,7.41 33.9,7.21 33.3,7.21 32.5,8.01 32.5,8.31 31.64,9.17 IC1.1 | RC.ANODE 44.66,6.65 44.2,7.11 v42.01,7.11 v42,7.1
  Bottom 0.152: v42,7.1 v41.99,7.11 v37.65,7.11
D4  (via drill 0.35)
  Top 0.152: IC1.2 31.64,8.37 32,8.01 32,7.8 33.19,6.61 36.69,6.61 v36.9,6.41 | JETSON.ANODE 44.57,3.92 43.45,5.04 43.45,6.16 v43.6,6.31
  Bottom 0.152: v36.9,6.41 37.1,6.41 37.2,6.31 v43.6,6.31
GND  (via drill 0.35)
  Top 0.152: IC1.5 30.04,5.97 28.6,7.41 27,7.41 | 26.5,5.61 26.5,6.91 27,7.41 | ICSP1.6 23.14,11.87 v22.7,12.31 23.4,13.01 25.7,13.01 26.6,12.11 | IC1.3 30.32,7.57 29.9,7.99 29.9,9.91 30.5,10.51 30.5,11.31 v29.7,12.11 29.6,12.11 28.8,12.91 28.8,13.61 29.5,14.31 29.5,16.64 | 26.6,12.11 26.6,10.86 C12.1 C3.1 27,8.66 27,7.41 | 26.6,12.11 v26.6,12.21 | 40.94,15.61 40.94,16.47 40.7,16.71 34.57,16.71 IC2.20 32,16.64 29.5,16.64 | 40.94,15.61 IC2.25 | 40.94,15.61 41.94,16.61 44.67,16.61 IC2.30 46.35,17.96 47.6,16.71 49.9,16.71 51.1,17.91 IC2.34 | IC2.34 52.35,16.71 57.5,16.71 58.72,15.49 IC2.39 60.72,15.42 v60.96,15.66 | IC2.9 21.89,16.68 24.43,16.68 IC2.14 26.15,17.96 27.47,16.64 29.5,16.64 | v38,5.51 38,6.51 38.26,6.77 IC1.21 41.25,6.77 C1.1 42.42,4.93 v41.8,4.31 | 25.9,5.01 v25.9,3.91 25.15,3.91 TP3.1 | v71,45.71 v72.9,45.71 v72.9,43.91 v72.9,42.01 v72.9,40.11 | v71,45.71 v71,43.91 v71,42.01 v71,40.11 v71,38.41 | v80.9,34 81.93,34 82.81,34.89 v82.81,35.53 83.95,36.68 85.3,36.68 86.61,37.99 v87.16,37.99 87.81,38.64 87.81,41.66 v87.56,41.91 | v76.13,41.15 73.94,41.15 v72.9,40.11 | 25.9,5.01 25.56,5.34 v25.04,5.34 | 26.5,5.61 25.9,5.01 | X2.2 27.5,3.97 27.13,4.34 v27.13,5.34 26.77,5.34 26.5,5.61 | v32.62,3.82 v33.57,4.77 33.57,4.01 v34.14,3.44 | IC2.34 52.61,19.46 60.64,19.46 60.8,19.3 60.8,17.65 v61.09,17.36 | v71,45.71 v71,47.71 v71,49.81 v71,51.81 v73.6,51.81 v76.1,51.81 v78.8,51.81 81.2,51.81 v81.3,51.91 v83.99,51.91 v86.56,51.91 v88.8,51.91 v91,51.91 | v91,48.81 v91,51.91 | v72.9,40.11 73.1,39.91 73.1,37.71 v73.4,37.41 73.4,34.61 | v43.6,3.91 43.1,3.41 43.1,3.11 43.5,2.71 v44.55,2.71 v46.2,2.71 48.9,2.71 49.35,3.16 R10.1 50.75,3.71 v50.9,3.56
  Top 0.152: v44.45,5.21 44.45,5.36 44.55,5.46 48.3,5.46 49.4,6.56 R5.1 49.4,5.16 v49.45,5.11 | 73.4,34.61 v73.1,34.31 72.95,34.46 v71.75,34.46 | v14.42,9.39 14.42,10.8 v14.86,11.24 | v14.86,11.24 v14.87,11.24 | v14.87,11.24 14.92,11.3 16.85,11.3 16.85,8.36 17.45,7.76 17.45,6.96 | v17.09,5.3 17.09,5.94 17.45,6.31 17.45,6.96 | v20.63,7.5 20.54,7.4 17.89,7.4 17.45,6.96 | R1.1 57.15,5.96 58.6,5.96 | 58.6,5.96 60.5,5.96 R3.1 62.52,4.84 v62.52,4.66 | v71.2,28.66 73.4,30.86 73.4,34.61 | v58.8,2.21 58.8,5.76 58.6,5.96 | v45.85,8.21 45.65,8.41 44.95,8.41 44.35,9.01 44.35,10.21 v43.7,10.86 42.95,10.11 42.1,10.11 41.85,10.36 40.5,10.36 v40.35,10.21 | v71.45,3.81 71.25,4.01 71.25,8.56 71.12,8.68 | 71.12,8.68 71.03,8.78 v70.6,8.78 | C4.1 71.53,8.68 71.12,8.68 | 72.69,13.12 U9.4 73.32,12.81 v74.15,12.81 | T5.2 69.4,14.31 70.05,14.31 70.3,14.06 70.3,13.51 70.7,13.11 72.68,13.11 | v74.35,15.86 74.25,15.96 74.25,17.06 73.63,17.68 U8.4 | v65.35,4.11 65.4,4.16 65.4,4.21 | 65.4,4.21 64.55,5.06 v64.55,6.66 | v70.5,27.86 70.5,26.31 69.94,25.75 69.94,20.23 69.89,20.18 v69.89,20.08 | C27.2 52.8,12.16 52.8,11.51 53,11.31 54,11.31 v54.7,10.61 54.7,9.41 54.1,8.81 | v66.66,5.61 66.66,5.46 65.4,4.21 | v67.7,3.01 70.65,3.01 v71.45,3.81 | 66.2,11.56 R24.1 66.2,10.71 v66.8,10.11 | 54.1,8.81 54.9,8.81 55.5,8.21 57,8.21 57.35,8.56 U$10.3 58.25,8.61 60.67,8.61 61.65,9.58 U$9.3 61.75,9.91 62.6,9.91 63.8,11.11 63.8,13.28 65.4,14.88 65.4,15.81 66,16.41 v66,16.91 67.2,16.91 C22.1 | 54.1,8.81 53.6,8.81 v53.3,8.51 | v91,51.91 v93.1,51.91 v95.2,51.91 v97.3,51.91 v97.3,49.11 97.3,46.71 v97.4,46.61 v97.4,44.01 v97.4,41.71 v97.4,38.91 v97.4,36.21 95.5,38.11 v95.1,38.11 93.5,39.71 v93,39.71 92.5,40.21 v92.5,42.11 92.4,42.21 v92.4,45.91
  Top 0.152: v35.5,11.91 v37.1,11.91 38,11.91 38.72,11.19 v38.72,10.89 | v73.55,0.89 71.45,2.99 v71.45,3.81 | v39.35,1 30.3,1 | 30.3,1 28.35,1 v28.25,0.89 | v28.25,0.89 22.85,0.89 v22.75,1 17.35,1 v17.25,0.89 v13.15,0.89 9.65,0.89 v9.45,1.09 9.45,2.79 v9.75,3.1 | v26.01,2 27.15,2 v28.25,0.89 | v30.81,2 30.3,1.49 30.3,1 | v12.22,12.59 12.72,12.59 v13.62,11.7 14.41,11.7 v14.86,11.24 | v14.87,11.24 14.87,11.64 v15.62,12.39
  Top 0.305: 72.68,13.11 72.69,13.12
  Bottom 0.152: C10.1 74.72,45.46 74.72,45.92 75.4,46.61 77.1,46.61 78.1,45.61 U1.2 80.3,45.61 80.5,45.41 80.5,44.8 | C7.1 74.88,35.28 74.88,36.53 C8.1 74.7,36.61 73.9,37.41 v73.4,37.41 | U1.6 80.25,43.61 80.5,43.36 | 74.68,42.56 R9.1 74.8,42.56 74.8,40.73 75.13,40.41 76.3,40.41 76.58,40.13 76.58,39.43 | v26.6,12.21 29.6,12.21 v29.7,12.11 | 12.1,4.2 SPI-LED.GND 12.25,4.2 | 12.1,4.2 10.61,4.2 8.7,6.11 8.7,10.76 | 8.7,10.76 8.7,16.21 9.2,16.71 19.33,16.71 IC2.9 | v25.9,3.91 27,2.81 35.6,2.81 | 35.6,2.81 38.5,1.71 39.4,2.61 39.4,4.11 v38,5.51 37.95,5.56 36.75,5.56 35.65,6.66 35.65,6.81 36.25,7.41 36.5,7.41 38.9,9.81 | 35.6,2.81 32.7,3.91 v32.62,3.82 | C10.1 C9.1 74.7,42.58 74.68,42.56 | 74.68,42.56 74.48,42.36 74.6,42.36 74.6,41.81 v72.9,40.11 | C11.1 76.58,39.43 | 76.58,39.43 76.62,39.48 | 76.62,39.48 76.75,39.61 | 76.75,39.61 77.7,39.61 | 77.7,39.61 U1.14 | 80.5,42.01 80.5,41.91 80.2,41.61 U1.10 77.6,41.61 77.2,41.21 77.2,40.06 76.75,39.61 | 80.5,42.01 80.5,42.52 | 80.5,42.52 80.5,42.61 | 80.5,42.61 80.5,43.11 | 80.5,43.11 80.5,43.36 | U1.7 80.5,43.11 | U1.8 80.5,42.61 | U1.9 80.4,42.11 80.5,42.01 | 80.5,44.8 80.5,43.36 | U1.15 78.2,39.11 77.7,39.61 | 76.62,39.48 77.5,38.61 U1.16 80,38.61 80.3,38.31 80.3,37.41 | U1.18 80.1,37.61 80.3,37.41 | 80.3,37.41 80.3,37.11 | 80.3,37.11 U1.19 | U1.21 80.2,36.11 80.3,36.21 | 80.3,36.21 80.3,37.11 | U1.23 80.2,35.11 80.26,35.17 | 80.26,35.17 80.3,35.21 80.3,36.21 | C10.1 73.15,45.46 v72.9,45.71 | v80.9,34 80.9,34.53 80.26,35.17 | v81.28,42.48 v81.28,44.77 80.54,44.77 80.5,44.8 | v81.28,42.48 81.24,42.52 80.5,42.52 | v81.28,42.48 86.99,42.48 v87.56,41.91 v87.56,46.81 89.56,48.81 v91,48.81
  Bottom 0.152: 12.25,4.2 12.3,4.2 | 12.3,4.2 13.22,4.2 v14.32,3.1 16.21,3.1 v16.51,3.39 | v16.51,3.39 17.09,3.97 v17.09,5.3 | v16.51,3.39 v18.61,3.39 | v18.61,3.39 19.32,4.11 v19.32,5.31 | v9.75,3.1 11.39,3.1 12.1,3.81 12.1,4.2 | v44.45,5.21 43.85,5.21 43.6,4.96 v43.6,3.91 43.2,4.31 v41.8,4.31 | v12.32,2.6 12.25,2.66 12.25,4.2 | v14.32,4.89 14.28,4.86 12.96,4.86 12.3,4.2 | v10.37,9.3 10.16,9.3 8.7,10.76 | IC4.14 64.42,9.04 64.42,9.27 v64.95,9.81 66.5,9.81 v66.8,10.11 68.4,10.11 U7.2 70.39,8.99 v70.6,8.78 | v65.45,7.86 64.4,8.91 64.4,6.81 v64.55,6.66 | IC4.24 58.54,2.47 v58.8,2.21 57.2,0.61 48.3,0.61 v46.2,2.71 | 57.1,8.26 57.25,8.41 IC4.3 | 56.45,8.26 56.05,8.26 55.95,8.36 IC4.1 54.7,10.26 v54.7,10.61 54.6,10.61 | 56.45,8.26 57.1,8.26 | 56.45,8.26 56.59,8.4 IC4.2 56.75,9.17 56.75,9.57 57.35,10.17 C28.2 | 57.1,8.26 57.75,8.26 | IC4.4 57.89,8.4 57.75,8.26 | v40.35,10.21 40.35,10.16 39.25,10.16 38.9,9.81 | v70.5,27.86 70.5,27.96 71.17,28.63 | 71.17,28.63 v71.2,28.66 | v70.45,29.26 71.08,28.63 71.17,28.63 | v18.61,3.39 19.71,3.39 v20.01,3.1 | v61.09,17.36 62.54,18.81 v67.8,18.81 69,18.81 | 57.75,8.26 58.35,8.26 58.55,8.46 IC4.5 | v50.9,3.56 52.23,3.56 C2.1 | U10.3 73.57,13.33 74.4,14.16 74.4,15.81 v74.35,15.86 73.2,17.01 72.23,17.01 | 69.5,18.81 v69.55,18.76 | 69.5,18.81 69.55,18.81 69.55,19.74 v69.89,20.08 | 69.5,18.81 69,18.81 | U11.3 72.23,17.01 | 72.23,17.01 71.23,16.01 69.7,16.01 69,16.71 69,18.81 | C16.1 66.96,5.31 v66.66,5.61 | U10.3 73.63,13.33 v74.15,12.81 | v62.52,4.66 64.8,4.66 v65.35,4.11 65.8,4.11 66.9,3.01 v67.7,3.01 | C17.1 72.37,13.86 U10.3 | v53.3,8.51 53,8.51 52.3,9.21 46.4,9.21 45.85,8.66 v45.85,8.21 44.95,9.11 44.5,9.11 44.4,9.21 v42.7,9.21
  Bottom 0.152: 38.9,9.81 38.9,10.71 v38.72,10.89 | v60.96,15.66 61.91,14.71 64.4,14.71 65.1,15.41 65.2,15.41 65.6,15.81 65.6,16.51 v66,16.91
  pour Top (rank 3): 7.05,20.66 68.7,20.66 68.7,54.61 99.9,54.61 99.9,-2.09 7.05,-2.09
  pour Bottom (rank 3): 6.35,0.51 6.35,24.43 8.55,26.63 65.05,26.63 65.05,51.11 73.86,59.93 95.3,59.93 100.75,54.48 100.75,-2.44 9.3,-2.44
N$2
  Bottom 0.152: R4.1 72.78,15.06 U11.1
N$3  (via drill 0.35)
  Top 0.152: IC3.3 77.51,21.56 79.85,21.56 v80.55,20.86
  Bottom 0.152: R19.1 79.45,19.86 Q1.D v80.55,20.86
N$4
  Top 0.152: IC1.20 40.35,5.97 C1.2
N$5
  Top 0.152: 29.34,2.77 X2.3 28.8,2.71 30.16,2.71 IC1.8
N$6
  Top 0.152: TP1.1 47.6,10.26 R12.1
N$7  (via drill 0.35)
  Top 0.152: R3.2 60.9,4.66 v59.55,4.66
  Bottom 0.152: v59.55,4.66 59.3,4.41 59.25,4.41 59.19,4.35 IC4.23
N$8  (via drill 0.35)
  Top 0.152: v58,4.61 56.8,4.61 R1.2
  Bottom 0.152: IC4.25 57.89,4.5 v58,4.61
N$9
  Top 0.152: U9.1 79.15,10.81 R15.1
N$10
  Top 0.152: U9.5 72.8,12.06 70.55,12.06 69.25,13.36 T5.1
N$11
  Top 0.152: T5.3 69.85,16.01 70.5,16.01 70.9,16.41 U8.5
N$12
  Top 0.152: R16.1 80.67,15.49 79.5,15.49 U8.1
N$13
  Bottom 0.152: R17.1 72.68,11.01 U10.1
N$14
  Bottom 0.152: 83.3,24.51 T6.1 83.1,24.71 83.1,23.66 83.3,23.46 83.8,23.46 83.95,23.31 83.95,19.31 83.85,19.21 83.85,17.01 87.8,13.06 87.8,12.36 87.4,11.96 80.05,11.96 79.9,11.81 79.45,11.81 U10.5
N$15
  Top 0.152: IC1.7 30.92,4.47 30.34,4.47 29.63,5.17 X2.1
N$16
  Bottom 0.152: C6.2 76.5,33.11 U1.27
N$17
  Top 0.152: R13.1 53.35,9.76 52.65,9.06 TP2.1
N$18
  Bottom 0.152: T6.3 81.15,22.61 81.25,22.51 81.25,17.61 79.95,16.31 U11.5
N$19
  Top 0.152: RC.CATHODE 46.37,6.71 R5.2
N$20
  Top 0.152: R10.2 46.53,3.71 JETSON.CATHODE
N$21
  Bottom 0.152: U1.26 79.08,33.56 78.15,33.56 77.85,33.86 75.55,33.86 C6.1
N$22
  Bottom 0.152: C5.1 75.55,32.26 77.65,32.26 78,32.61 U1.28
N$23
  Bottom 0.152: U1.29 79.01,31.98 78.29,31.98 77.76,31.46 C5.2
N$24
  Bottom 0.152: R9.2 76.65,42.81 77.4,42.81 77.6,43.01 77.6,43.61 78.1,44.11 U1.5
N$25
  Bottom 0.152: C9.2 76.45,44.11 77.4,44.11 77.9,44.61 U1.4
N$26
  Bottom 0.152: C10.2 77.55,45.46 77.9,45.11 U1.3
N$27
  Bottom 0.152: R8.1 76.6,38.11 76.8,38.11 | 76.8,38.11 U1.17 | U1.20 78.2,36.61 76.8,38.01 76.8,38.11
N$28
  Bottom 0.152: R7.1 73.2,36.46 72.7,36.96 | 72.7,36.96 70.65,36.96 70.4,36.71 70.4,30.61 71.08,29.93 D1.ANODE | R8.2 C11.2 74.3,38.86 73.1,38.86 72.15,37.91 72.15,37.51 72.7,36.96
N$29  (via drill 0.35)
  Top 0.152: D3.CATHODE 84.25,20.96 84.25,21.01 84.55,21.31 v84.9,21.31 | v88,15.51 87.65,15.51 87.3,15.86 U$14.2
  Bottom 0.152: v84.9,21.31 85.35,21.31 85.65,21.01 85.65,17.86 v88,15.51
N$30
  Top 0.152: D4.ANODE 88.36,13.46 2.I/O
N$31
  Bottom 0.152: C14.2 85.8,28.51 IC5.4
N$32  (via drill 0.35)
  Top 0.152: v85.95,27.41 85.95,27.61 87.6,29.26 89.2,29.26 90.45,28.01 R31.2
  Bottom 0.152: v85.95,27.41 85.95,26.31 IC5.3
N$33  (via drill 0.35)
  Top 0.152: v82.35,7.36 83.6,7.36 U$8.4
  Bottom 0.152: R25.2 81.45,5.41 82.35,6.31 v82.35,7.36
N$34  (via drill 0.35)
  Top 0.152: v74.5,24.16 74.5,26.06 75.9,27.46 79.56,27.46 79.77,27.66 79.85,27.66 80.1,27.91 v80.15,27.91
  Bottom 0.152: Q2.S 75.28,22.83 74.5,22.06 73.55,22.06 73.35,22.26 73.35,23.36 74.15,24.16 v74.5,24.16 | T6.4 81.08,27.43 80.63,27.43 v80.15,27.91
N$35
  Top 0.152: R21.2 80.65,19.16 81.9,20.41 81.9,22.36 82.4,22.86 87,22.86 87.95,21.91 87.95,21.15 TH.I/O
N$36
  Top 0.152: ST.I/O 88.35,23.29 83.37,23.29 82.05,24.61 R20.2
N$37
  Bottom 0.152: T6.6 83.05,26.96 82.15,26.06 81.15,26.06 80.4,25.31 Q1.S
N$38
  Bottom 0.152: R25.1 76.42,6.24 U3.1
N$39
  Bottom 0.152: R11.1 77.1,25.61 76.8,25.31 75.75,25.31 75.25,24.81 75.25,23.96 Q2.G
N$40
  Bottom 0.152: R18.1 77.92,22.84 Q1.G
N$41
  Top 0.152: R26.2 82.55,15.76 83.3,15.76 83.9,16.36 U$14.4
N$42  (via drill 0.35)
  Top 0.152: v75.99,26.05 76.65,26.71 78.95,26.71 79.6,26.06 79.6,25.81 78.8,25.01 78.8,23.71 78.6,23.51 77.51,23.51 IC3.6 77.46,23.46 76.16,23.46 75.5,22.79 75.5,21.96 75.93,21.52 v76.27,21.52
  Bottom 0.152: Q2.D 75.65,21.52 v76.27,21.52 | v75.99,26.05 75.65,25.71 R14.1
N$43
  Bottom 0.152: R30.1 68.06,8.82 69.17,7.72 U7.1
N$44
  Top 0.152: U$7.4 82.65,11.86 R27.2
N$45
  Top 0.152: 88.67,16.84 1.I/O 88,18.05 87.97,18.05 87.2,18.83 87.2,18.86 D3.ANODE
N$46
  Top 0.152: D4.CATHODE 84.35,13.46 85.35,12.46 85.35,11.41 85.85,10.91 U$7.2
N$47
  Top 0.152: D5.CATHODE 87.85,7.91 87.85,6.06 87.75,5.96 U$8.2
N$48  (via drill 0.35)
  Top 0.152: v60.7,11.21 U$9.2
  Bottom 0.152: IC4.7 59.84,10.35 v60.7,11.21
N$49  (via drill 0.35)
  Top 0.152: 56.5,9.61 U$10.2 56.4,10.31 56.7,10.61 58.2,10.61 v58.5,10.31
  Bottom 0.152: IC4.6 59.19,9.6 59.2,9.61 v58.5,10.31
PCH1  (via drill 0.35)
  Top 0.152: 80.75,17.11 R16.2 | R16.2 79.8,16.26 78.3,16.26 78.15,16.41 v77.81,16.41 | IC3.2 77.38,20.78 76.08,20.78 75.85,21.01 75.25,21.01 75.1,20.86 75.1,19.81 75.6,19.31 77,19.31 v77.1,19.41 | R16.2 R26.1
  Bottom 0.152: v77.1,19.41 77.1,17.41 77.81,16.71 v77.81,16.41
PCH2
  Top 0.152: 80.75,14.01 R15.2 | R15.2 80.65,14.11 77.3,14.11 76.5,14.91 76.5,17.96 76.9,18.36 79.55,18.36 79.7,18.51 79.7,19.9 79.95,20.15 81.04,20.15 81.25,20.36 81.25,22.46 80.88,22.83 IC3.5 | R27.1 80.8,13.96 R15.2
PCH3  (via drill 0.35)
  Top 0.152: IC1.26 37.13,10.47 37.2,10.4 37.2,9.62 37.4,9.42 38.35,9.42 40.54,11.61 41.4,11.61 41.86,11.15 v41.99,11.15 | v66.8,6.91 66.8,7.01 67.9,8.11 R24.2 67.9,9.41 65.5,7.01 65.35,7.01 64.65,7.71 v63.55,7.71
  Bottom 0.152: v63.55,7.71 55.8,7.71 53.6,9.91 43.24,9.91 v41.99,11.15 | U3.3 68.75,4.26 66.9,4.26 65.7,5.46 65.7,5.91 66.7,6.91 v66.8,6.91
PCH4  (via drill 0.35)
  Top 0.152: v68,14.06 68,13.27 69.12,12.16 v69.25,12.16 69.25,10.96 TP4.TP | U$10.4 57.35,12.91 58.05,13.61 v61.3,13.61
  Bottom 0.152: v69.25,12.16 69.25,11.06 R17.2 | v61.3,13.61 62.8,13.61 63.23,14.04 67.98,14.04 v68,14.06
PCH5  (via drill 0.35)
  Top 0.152: v62.8,11.21 61.65,12.36 U$9.4 62.55,13.31 TP5.TP
  Bottom 0.152: R4.2 69.2,13.96 66.45,11.21 v62.8,11.21
PCH6  (via drill 0.35)
  Top 0.152: v76.1,20.11 76.1,20.18 77.43,20.18 IC3.1
  Bottom 0.152: v76.1,20.11 76.1,18.4 76.8,17.7 76.8,17.29 76.8,17.28 76.8,16.41 76.5,16.11 76.5,11.26 75.99,10.75 U7.3 76.31,9.31 R29.2
PCH_1  (via drill 0.35)
  Top 0.152: IC1.32 32.35,10.41 32.35,10.06 34.5,7.91 v38.1,7.91
  Bottom 0.152: v38.1,7.91 39.65,9.46 40.95,9.46 41.15,9.66 v41.45,9.66 42.8,8.31 44.58,8.31 46.28,6.61 53.15,6.61 54.3,5.46 64.3,5.46 66.4,7.56 R30.2
PCH_3  (via drill 0.35)
  Top 0.152: v79.3,7.26 79.3,7.76 79.9,8.36 80.3,8.36 80.9,8.96 80.9,9.31 | 80.9,9.31 R6.2 81.25,9.76 | 3.I/O 89.21,10.65 90,9.86 90.2,9.86 90.9,9.16 90.9,8.01 D5.ANODE 90.95,7.26 v89.25,5.56 | v82.9,8.36 81.85,8.36 80.9,9.31
  Bottom 0.152: 78.95,6.91 v79.3,7.26 | v89.25,5.56 85.95,5.56 83.15,8.36 v82.9,8.36
PH1-328  (via drill 0.35)
  Top 0.152: IC1.23 40.79,8.37 v40.95,8.21 | v51.95,4.61 54.15,6.81 54.9,6.81 55.5,7.41 60.8,7.41 64.25,10.86 64.25,13.26 65.75,14.76 65.75,15.11 66.06,15.41 T5.4
  Bottom 0.152: v51.95,4.61 50.2,4.61 49.77,4.18 46.06,4.18 45.45,4.79 45.45,6.16 43.8,7.81 41.35,7.81 v40.95,8.21
PH2_328  (via drill 0.35)
  Top 0.152: IC1.24 40.92,9.17 42.44,7.65 50.44,7.65 51.05,8.26 51.65,8.26 52.44,7.46 53.74,7.46 54.14,7.86 v54.4,7.86 | v63.3,6.45 62.7,7.06 62.7,8.01 63.35,8.66 64.75,8.66 65.8,9.71 65.8,10.41 65.2,11.01 65.2,12.36 66.35,13.51 T5.6
  Bottom 0.152: v54.4,7.86 55,7.86 55.95,6.91 58.55,6.91 v58.9,6.56 59,6.45 v63.3,6.45
RCH1  (via drill 0.35)
  Top 0.152: IC3.4 80.28,22.18 v80.5,21.96 | R20.1 80.2,24.62 79.46,23.88 v79.46,23.73
  Bottom 0.152: v79.46,23.73 79.46,22.45 79.95,21.96 v80.5,21.96
RCH2
  Top 0.152: IC3.7 77.43,24.08 75.68,24.08 74.65,23.06 74.65,19.71 75.55,18.81 78.5,18.81 R21.1
SCL  (via drill 0.35)
  Top 0.152: v35.8,8.91 35.52,9.19 IC1.28 | v82.35,32.21 82.35,31.66 81.5,30.81 | 81.5,30.81 v79.25,30.81 | v55.4,6.21 55.7,5.91 55.7,5.01 v55.3,4.61 | 81.5,30.81 78.5,27.81 75.7,27.81 73.1,25.21 73.1,22.31 74.2,21.21 74.2,19.46 73.55,18.81 70.7,18.81 69.9,18.01 67.1,18.01 66.5,18.61 62.5,18.61 61.85,17.96 61.85,15.31 60.65,14.11 50.1,14.11 v49.9,14.31 49.9,13.21 v50.4,12.71 | v48.7,8.51 48.7,9.61 49.6,10.51 v49.8,10.51
  Bottom 0.152: IC2.5 15.54,14.37 16,13.91 32.5,13.91 | 32.5,13.91 34.5,13.91 34.7,14.11 49.7,14.11 v49.9,14.31 | 32.5,13.91 35.9,10.51 35.9,9.01 v35.8,8.91 | U1.13 80.5,40.11 81.8,38.81 81.8,32.71 82.3,32.21 v82.35,32.21 | v79.25,30.81 79.25,29.81 R22.1 | IC4.26 57.24,3.87 56.5,4.61 v55.3,4.61 | v55.4,6.21 55.35,6.26 54.34,6.26 52.1,8.51 v48.7,8.51 | v49.8,10.51 49.8,12.11 v50.4,12.71
SDA  (via drill 0.35)
  Top 0.152: v30.25,13.21 31.25,12.21 31.25,10.21 31.45,10.01 31.5,10.01 33.3,8.21 v33.3,8.01 | v36.9,8.81 36.32,9.39 IC1.27 | v77.75,30.66 79.1,32.01 80.6,32.01 82.3,33.71 v83.1,33.71 | v73.7,28.51 73.7,26.41 72.65,25.36 72.65,22.26 73.5,21.41 73.5,19.81 73.1,19.41 67.1,19.41 66.9,19.21 v62.1,19.21 | v56.45,2.21 55.5,2.21 53.85,3.86 v53.85,4.86 | v51.05,5.86 51.05,7.26 v51.2,7.41 | v47.2,8.41 46.4,9.21 45.2,9.21 44.9,9.51 44.9,11.01 43.82,12.08 39.23,12.08 v39.12,11.98
  Bottom 0.152: IC2.3 13,13.62 13.41,13.21 v30.25,13.21 | v33.3,8.01 36.2,8.01 36.9,8.71 v36.9,8.81 36.9,10.46 38.42,11.98 v39.12,11.98 40.75,13.61 54.23,13.61 54.6,13.24 54.6,12.41 55.2,11.81 56,11.81 56.3,12.11 56.3,13.01 56.7,13.41 59.2,13.41 60.2,14.41 60.2,18.21 61.2,19.21 v62.1,19.21 | U1.11 81.2,41.11 81.7,40.61 | 81.7,40.61 83.6,38.71 83.6,33.99 83.31,33.71 v83.1,33.71 | U1.12 81.7,40.61 | v77.75,30.66 76.53,30.66 75.15,30.66 74.6,30.11 74.6,28.36 73.75,27.51 73.38,27.51 R23.1 73.08,27.89 v73.7,28.51 | IC4.27 56.59,2.35 v56.45,2.21 | v53.85,4.86 53.5,4.51 53.3,4.51 52.55,5.25 52.52,5.25 51.92,5.86 v51.05,5.86 | v51.2,7.41 48.2,7.41 v47.2,8.41
VCC_R  (via drill 0.35)
  Top 0.152: v72.7,20.26 72.68,20.23 IC3.16 | R31.1 90.4,26.21 90.4,24.76 90.05,24.41 88.95,24.41 88.58,24.78 88.73,24.93 | C21.2 88.5,25.16 88.73,24.93 | 88.73,24.93 89.2,25.41 89.35,25.41 v89.6,25.16 | v77.15,8.16 77.15,9.21 C19.2
  Bottom 0.152: v72.7,20.26 74.3,20.26 75,19.56 75,8.26 75.54,7.72 U7.4 76.43,8.16 v77.15,8.16
  Bottom 0.254: 72,24.81 72,24.86 74.96,27.81 74.96,28.96 75.3,29.31 75.8,29.31 76.4,28.71 76.4,28.61 76.7,28.31 79.45,28.31 79.65,28.51
  Bottom 0.305: 72,24.81 72,20.96 v72.7,20.26 72.7,19.81 C20.2 | IC5.1 88.75,26.16 | 88.75,26.16 89.05,26.16 89.45,26.56 89.45,28.96 88.55,29.86 88.55,35.86 87.85,36.56 87.05,36.56 83.65,33.16 83.65,28.91 83.35,28.61 79.75,28.61 79.65,28.51 | IC5.1 87.9,25.96 | D2.C 87.7,25.16 IC5.1 | 88.75,26.16 89.6,25.31 v89.6,25.16
VCC_RC  (via drill 0.35)
  Top 0.152: 91.72,11.13 3.VCC 2.VCC 91.72,14.33 91.75,14.36 1.VCC TH.VCC | TH.VCC 91.77,19.78 91.77,19.57 90.55,18.36 88.55,18.36 87.5,19.41 87.5,21.11 86.55,22.06 v83.05,22.06 | v80.65,18.19 80.7,18.14 81.53,18.14 81.95,18.56 v81.95,19.36 | ST.VCC TH.VCC
  Bottom 0.152: v80.65,18.19 80.43,18.41 79.2,18.41 R19.2 78,19.61 78,21.06 77.05,22.01 76.87,22.01 76.7,22.18 75.66,22.18 75.23,21.76 74.84,21.76 74.49,21.41 73.55,21.41 72.76,22.19 72.76,24.17 R14.2 | v81.95,19.36 81.95,19.46 83.05,20.56 v83.05,22.06
  Bottom 0.254: 90.35,23.83 ST.VCC
  Bottom 0.305: 90.35,23.83 87.12,23.83 86.15,24.81 85.75,24.81 D2.A
  pour Top (no thermals): 90.5,23.51 92.95,23.51 92.95,9.86 90.5,9.86
VCC_RC1  (via drill 0.35)
  Top 0.152: v85.4,32.06 85.4,31.21 86.35,30.26 90.35,30.26 95.25,25.36 v95.25,25.16 | v82.8,10.71 83.55,9.96 U$7.5 84.45,9.96 84.75,9.66 84.75,8.66 C25.2 85.35,7.56 85.35,5.51 84.85,5.01 U$8.5 83.9,4.86 C26.2 | U$14.5 84.45,14.91 85,15.46 85,17.46 84.35,18.11 C13.1 84.05,18.56 v82.7,18.56 | v93,9.36 94.6,9.36 v95.25,8.71
  Bottom 0.152: C18.2 80.73,10.98 | 80.73,10.98 80.53,10.79 U10.6 78.22,10.79 76.9,12.11 76.9,15.11 77.28,15.49 78.65,15.49 U11.6 80.53,15.04 C23.2 82.7,17.21 v82.7,18.56 | R18.2 78.9,25.36 79.6,25.36 80.1,25.86 | R11.2 79.2,25.86 80.1,25.86 | 80.1,25.86 80.35,25.86 80.95,26.46 81.5,26.46 82.1,27.06 T6.5 82.1,28.21 83.9,28.21 84.75,29.06 84.75,29.71 85.3,30.26 86.2,30.26 | C24.2 87.6,33.41 86.1,33.41 85.4,32.71 v85.4,32.06 85.4,31.06 86.2,30.26 | IC5.5 87.7,30.26 | 87.7,30.26 C15.2 | 86.2,30.26 87.7,30.26 | 80.73,10.98 81,10.71 v82.8,10.71 83,10.91 86.9,10.91 88.32,9.49 88.45,9.49 88.58,9.36 v93,9.36 | v95.25,8.71 95.6,8.71 96.4,9.51 96.4,24.01 v95.25,25.16

### Text on the board
tPlace: JETSON | RC | Designed in Aizu | #612 | REV 2.0.10
bPlace: F-612-2-10-A-N-J-0-P
tDocu: OLED AREA | RX | TX | GND